# Altium project uAMDC.PrjPcb (part 1 of 3)
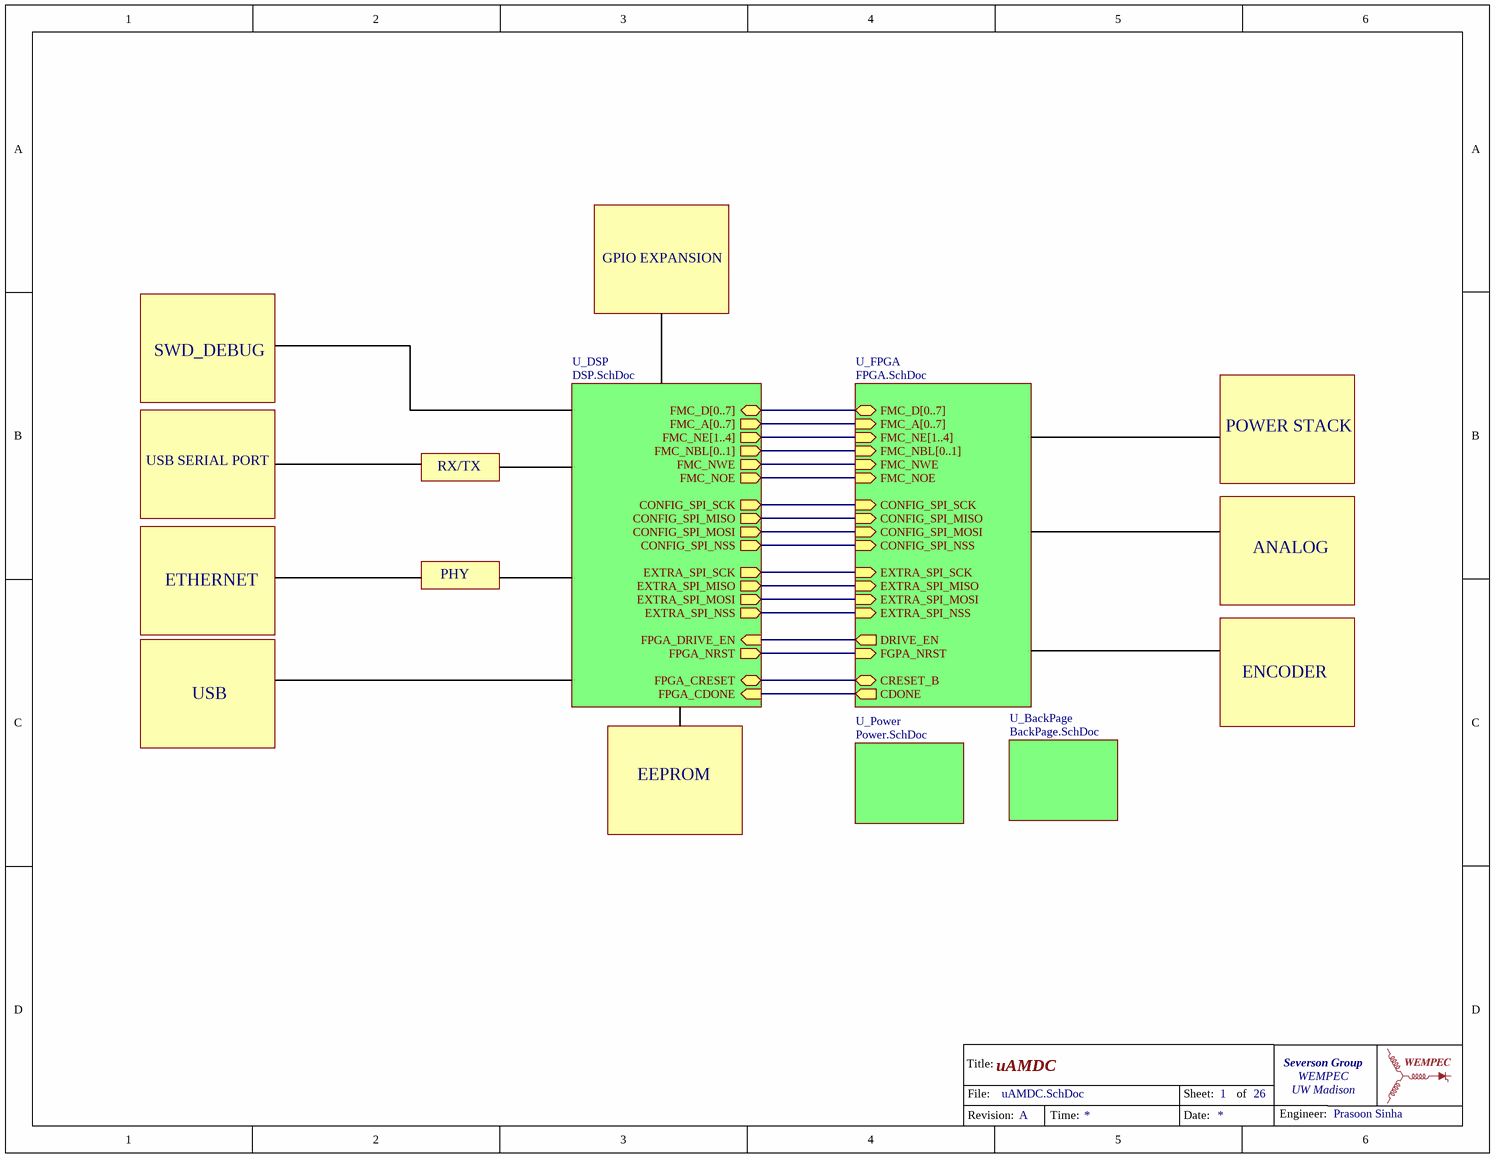
[diagram p0: uAMDC.SchDoc]
ProjectGroup: Severson Group; ProjectOrganization: WEMPEC; ProjectRev: A; ProjectUniversity: UW Madison
26 sheets, 427 parts. Net scope: hierarchical (ports join the sheet entries above them; power ports are global).
Board files: AMDC_uAMDC_Overlay.PcbDoc, uAMDC.PcbDoc
Sheets:
  uAMDC.SchDoc
    U_DSP = DSP.SchDoc
      U_GPIO = GPIO.SchDoc
        isoSPI1_Interface = isoSPI.SchDoc
        U_TranslationSPI_A = TranslationDir8Chan.SchDoc
        U_TranslationSPI_C = TranslationDir8Chan.SchDoc
        isoSPI2_Interface = isoSPI.SchDoc
        isoSPI3_Interface = isoSPI.SchDoc
        isoSPI4_Interface = isoSPI.SchDoc
      U_USB_UART = USB_UART.SchDoc
      U_SWD = SWD.SchDoc
      U_USB = USB.SchDoc
      U_Ethernet = Ethernet.SchDoc
    U_FPGA = FPGA.SchDoc
      U_DriveInterface = DriveInterface.SchDoc
        U_InverterConnectors = InverterConnectors.SchDoc
          InverterConnector1AB = InverterConnector.SchDoc
          InverterConnector2AB = InverterConnector.SchDoc
        U_InverterTranslation = InverterTranslation.SchDoc
          U_LVHV8ChanTranslation4 = LVHV8ChanTranslation.SchDoc
          U_LVHV8ChanTranslation5 = LVHV8ChanTranslation.SchDoc
          U_LVHV8ChanTranslation6 = LVHV8ChanTranslation.SchDoc
          U_TranslationStsA = TranslationDir8Chan.SchDoc
          U_TranslationStsB = TranslationDir8Chan.SchDoc
          U_TranslationStsC = TranslationDir8Chan.SchDoc
          U_TranslationStsD = TranslationDir8Chan.SchDoc
      U_AnalogInterface = AnalogInterface.SchDoc
        U_AnalogADC = AnalogADCs.SchDoc
        U_AnalogConnectors = AnalogConnectors.SchDoc
        U_AnalogConditioning = AnalogConditioning.SchDoc
          AnalogSigCond_A = AnalogSigCond.SchDoc
          AnalogSigCond_B = AnalogSigCond.SchDoc
      U_Encoder = Encoder.SchDoc
      U_BoardIO = FPGA_IO.SchDoc
    U_Power = Power.SchDoc
      U_Power_Protection = Power_Protection.SchDoc
      U_Power_InrushLimit = Power_InrushLimit.SchDoc
    U_BackPage = BackPage.SchDoc

## Sheet uAMDC.SchDoc: uAMDC
size 279 x 215 mm; Engineer: Prasoon Sinha; DocumentNumber: 1; SheetNumber: 1; SheetTotal: 26

### Parts
(Parts that share a designator on the sheet are numbered #1, #2 ... from top to bottom, then left to right.)
*?#1  TitleBlockWEMPEC  (value not drawn)  (graphical)

### Sub-sheets
U_BackPage = BackPage.SchDoc: no entries
U_DSP = DSP.SchDoc: FMC_A[0..7] (out), FMC_NBL[0..1] (out), FMC_D[0..7] (bidir), FMC_NWE (out), FMC_NOE (out), FMC_NE[1..4] (out), FPGA_DRIVE_EN (in), FPGA_CDONE (in), FPGA_NRST (out), EXTRA_SPI_SCK (out), CONFIG_SPI_MISO (out), CONFIG_SPI_MOSI (out), EXTRA_SPI_NSS (out), FPGA_CRESET (bidir), CONFIG_SPI_SCK (out), CONFIG_SPI_NSS (out), EXTRA_SPI_MOSI (out), EXTRA_SPI_MISO (out)
U_FPGA = FPGA.SchDoc: FMC_NWE (in), FMC_NE[1..4] (in), FMC_NBL[0..1] (in), FMC_A[0..7] (in), FMC_D[0..7] (bidir), FMC_NOE (in), CDONE (out), DRIVE_EN (out), FGPA_NRST (in), CONFIG_SPI_SCK (in), CONFIG_SPI_MOSI (in), CRESET_B (bidir), EXTRA_SPI_SCK (in), CONFIG_SPI_NSS (in), EXTRA_SPI_MISO (in), EXTRA_SPI_MOSI (in), EXTRA_SPI_NSS (in), CONFIG_SPI_MISO (in)
U_Power = Power.SchDoc: no entries

### Nets
CDONE: sheet U_DSP/FPGA_CDONE, sheet U_FPGA/CDONE
CONFIG_SPI5_MISO: sheet U_DSP/CONFIG_SPI_MISO, sheet U_FPGA/CONFIG_SPI_MISO
CONFIG_SPI5_MOSI: sheet U_DSP/CONFIG_SPI_MOSI, sheet U_FPGA/CONFIG_SPI_MOSI
CONFIG_SPI5_NSS: sheet U_DSP/CONFIG_SPI_NSS, sheet U_FPGA/CONFIG_SPI_NSS
CONFIG_SPI5_SCK: sheet U_DSP/CONFIG_SPI_SCK, sheet U_FPGA/CONFIG_SPI_SCK
CRESET_B: sheet U_DSP/FPGA_CRESET, sheet U_FPGA/CRESET_B
DRIVE_EN: sheet U_DSP/FPGA_DRIVE_EN, sheet U_FPGA/DRIVE_EN
EXTRA_SPI6_MISO: sheet U_DSP/EXTRA_SPI_MISO, sheet U_FPGA/EXTRA_SPI_MISO
EXTRA_SPI6_MOSI: sheet U_DSP/EXTRA_SPI_MOSI, sheet U_FPGA/EXTRA_SPI_MOSI
EXTRA_SPI6_NSS: sheet U_DSP/EXTRA_SPI_NSS, sheet U_FPGA/EXTRA_SPI_NSS
EXTRA_SPI6_SCK: sheet U_DSP/EXTRA_SPI_SCK, sheet U_FPGA/EXTRA_SPI_SCK
FMC_NOE: sheet U_DSP/FMC_NOE, sheet U_FPGA/FMC_NOE
FMC_NWE: sheet U_DSP/FMC_NWE, sheet U_FPGA/FMC_NWE
FPGA_NRST: sheet U_DSP/FPGA_NRST, sheet U_FPGA/FGPA_NRST

### Buses and harness runs
bus sheet U_DSP/FMC_A[0..7] = sheet U_FPGA/FMC_A[0..7]
bus sheet U_DSP/FMC_D[0..7] = sheet U_FPGA/FMC_D[0..7]
bus sheet U_DSP/FMC_NBL[0..1] = sheet U_FPGA/FMC_NBL[0..1]
bus sheet U_DSP/FMC_NE[1..4] = sheet U_FPGA/FMC_NE[1..4]

### Notes on the sheet
- GPIO EXPANSION
- SWD_DEBUG
- POWER STACK
- USB SERIAL PORT
- RX/TX
- ANALOG
- ETHERNET
- PHY
- USB
- ENCODER
- EEPROM
- (in symbol TitleBlockWEMPEC) Title:; File:; Sheet:; of; Engineer:; Revision:; Time:; Date:

## Sheet DSP.SchDoc: DSP Interface
size 431 x 254 mm; Engineer: Prasoon Sinha; DocumentNumber: 2; SheetNumber: 2; SheetTotal: 26
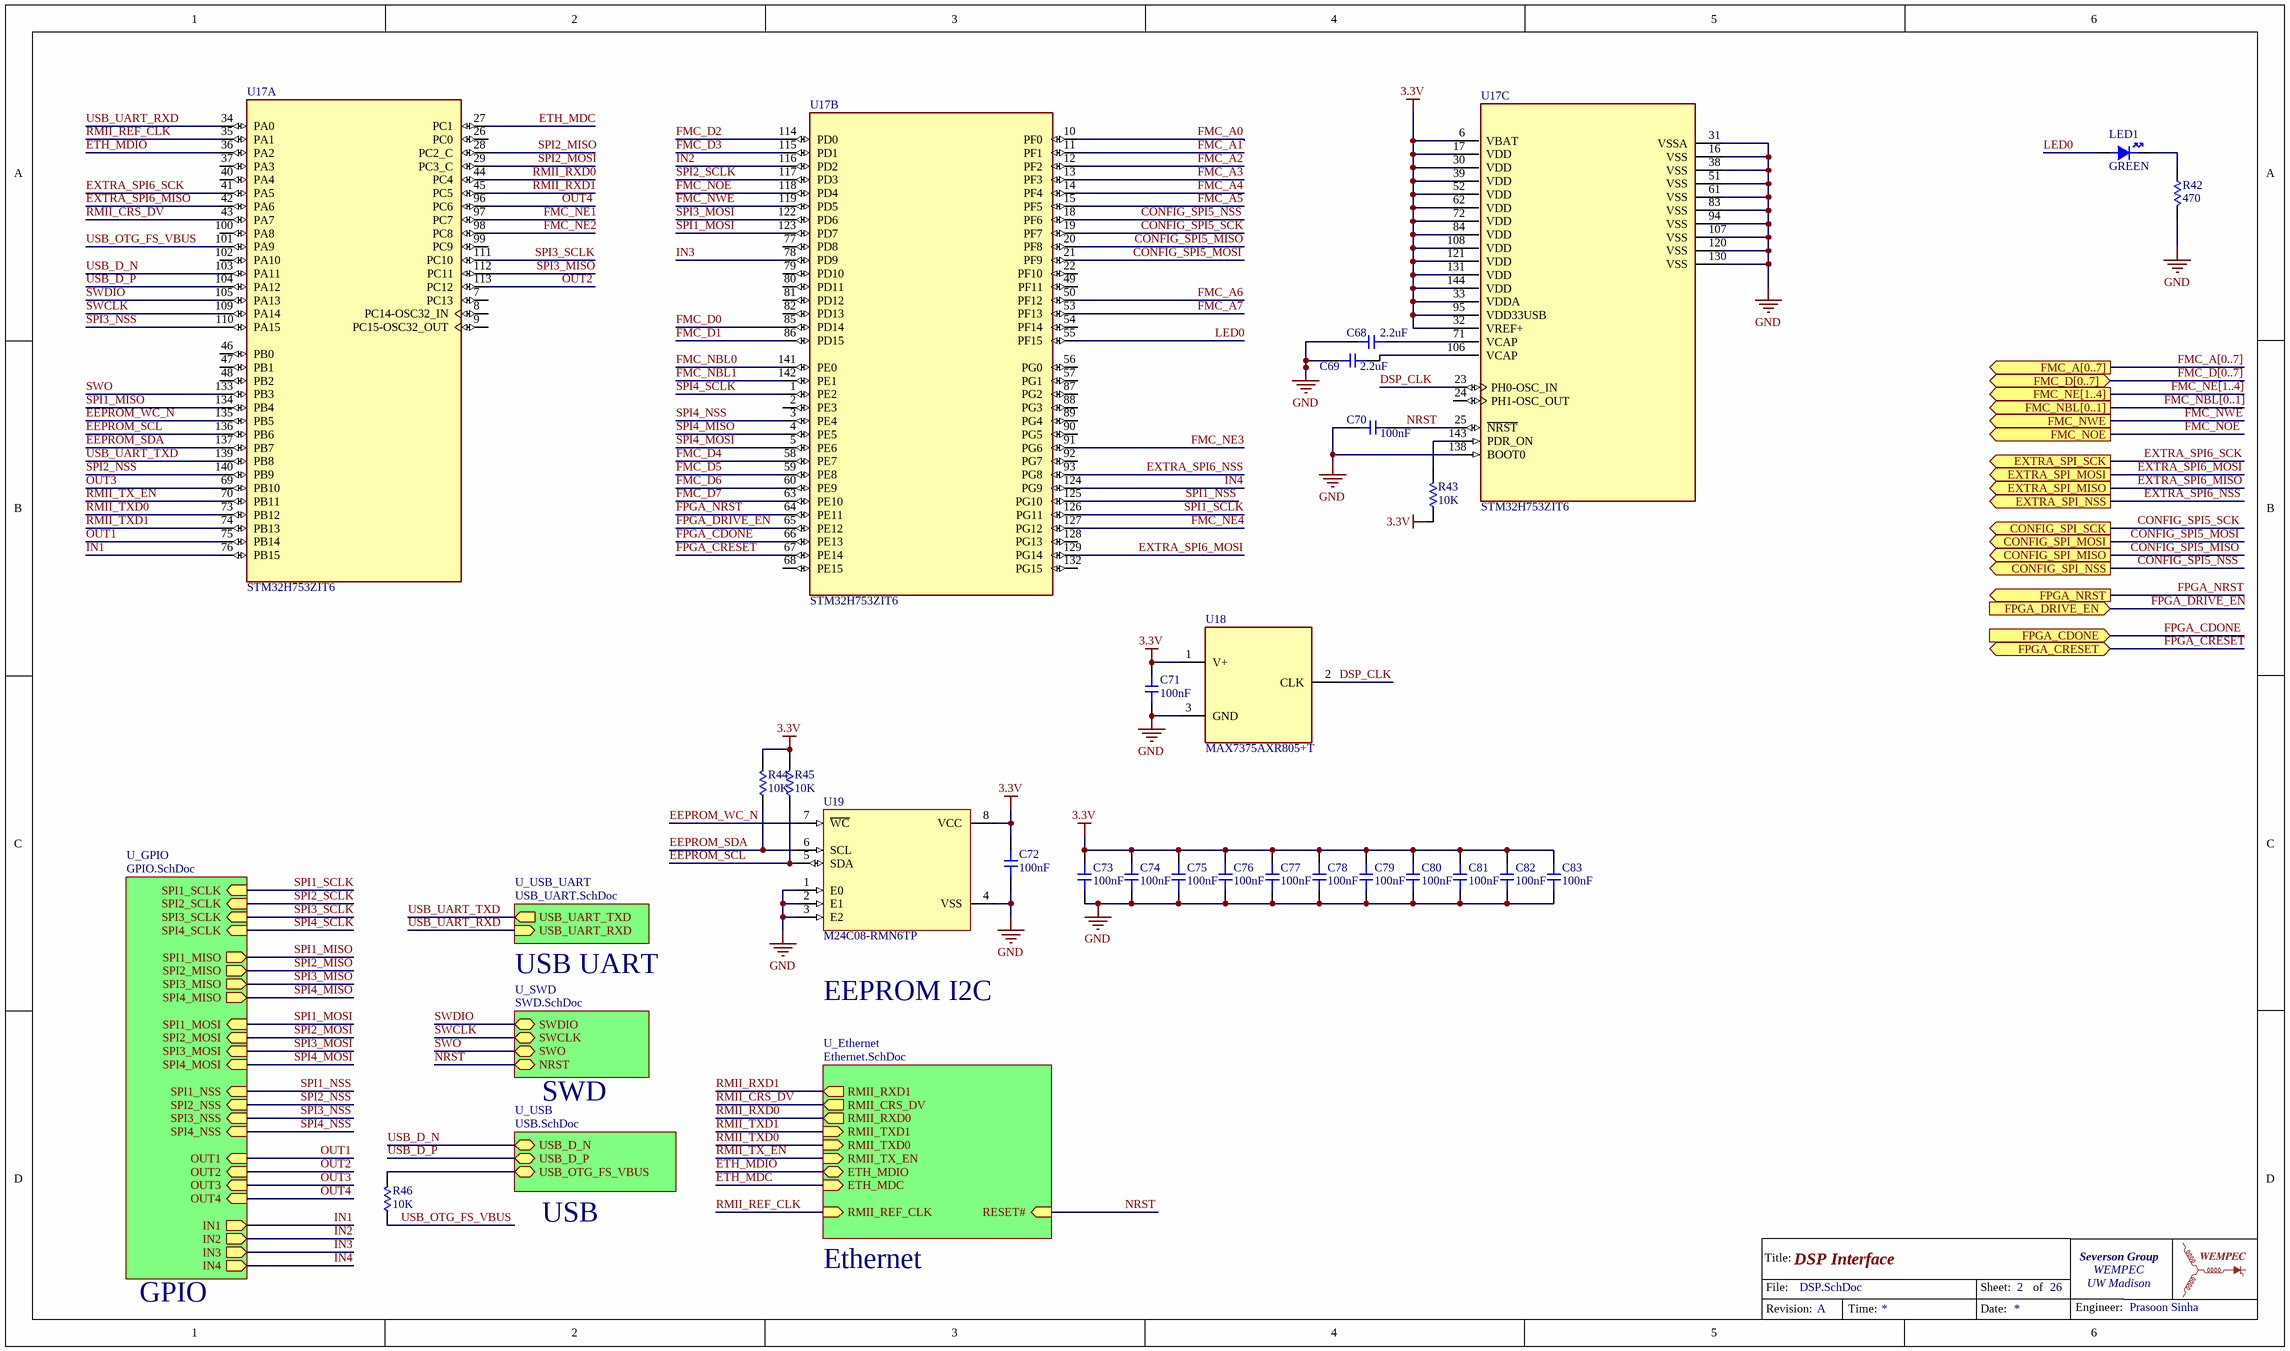
[diagram p1: DSP.SchDoc]

### Parts
(Parts that share a designator on the sheet are numbered #1, #2 ... from top to bottom, then left to right.)
*?#2  TitleBlockWEMPEC  (value not drawn)  (graphical)
C68  value 2.2uF  [0603-CAP]  (hidden comment: Capacitor)
C69  value 2.2uF  [0603-CAP]  (hidden comment: Capacitor)
C70  value 100nF  [0603-CAP]  (hidden comment: Capacitor)
C71  value 100nF  [0603-CAP]  (hidden comment: Capacitor)
C72  value 100nF  [0603-CAP]  (hidden comment: Capacitor)
C73  value 100nF  [0603-CAP]  (hidden comment: Capacitor)
C74  value 100nF  [0603-CAP]  (hidden comment: Capacitor)
C75  value 100nF  [0603-CAP]  (hidden comment: Capacitor)
C76  value 100nF  [0603-CAP]  (hidden comment: Capacitor)
C77  value 100nF  [0603-CAP]  (hidden comment: Capacitor)
C78  value 100nF  [0603-CAP]  (hidden comment: Capacitor)
C79  value 100nF  [0603-CAP]  (hidden comment: Capacitor)
C80  value 100nF  [0603-CAP]  (hidden comment: Capacitor)
C81  value 100nF  [0603-CAP]  (hidden comment: Capacitor)
C82  value 100nF  [0603-CAP]  (hidden comment: Capacitor)
C83  value 100nF  [0603-CAP]  (hidden comment: Capacitor)
LED1  value GREEN  [0603-LED]  (hidden comment: LED)
R42  value 470  [0603-RES]  (hidden comment: Resistor)
R43  value 10K  [0603-RES]  (hidden comment: Resistor)
R44  value 10K  [0603-RES]  (hidden comment: Resistor)
R45  value 10K  [0603-RES]  (hidden comment: Resistor)
R46  value 10K  [0603-RES]  (hidden comment: Resistor)
U17  STM32H753ZIT6  [QFP50P2200X2200X160-144N]  (parts A,B,C of 3)
U18  MAX7375AXR805+T  [SOT65P210X110-3N]
U19  M24C08-RMN6TP  [SOIC127P600X175-8N]

### Sub-sheets
U_Ethernet = Ethernet.SchDoc: RMII_RXD1 (out), RMII_CRS_DV (out), RMII_RXD0 (out), RMII_TXD1 (in), RMII_TXD0 (in), RMII_TX_EN (in), ETH_MDIO (bidir), ETH_MDC (in), RESET# (in), RMII_REF_CLK (in)
U_GPIO = GPIO.SchDoc: IN1 (out), IN3 (out), IN4 (out), OUT2 (in), OUT4 (in), OUT3 (in), OUT1 (in), IN2 (out), SPI4_MISO (out), SPI2_SCLK (in), SPI2_MISO (out), SPI1_SCLK (in), SPI1_MISO (out), SPI4_NSS (in), SPI2_NSS (in), SPI1_MOSI (in), SPI3_MOSI (in), SPI4_MOSI (in), SPI3_MISO (out), SPI3_SCLK (in), SPI1_NSS (in), SPI2_MOSI (in), SPI4_SCLK (in), SPI3_NSS (in)
U_SWD = SWD.SchDoc: NRST (bidir), SWO (bidir), SWCLK (bidir), SWDIO (bidir)
U_USB = USB.SchDoc: USB_D_N (bidir), USB_D_P (bidir), USB_OTG_FS_VBUS (bidir)
U_USB_UART = USB_UART.SchDoc: USB_UART_RXD (in), USB_UART_TXD (out)

### Ports
CONFIG_SPI_MISO (out), CONFIG_SPI_MOSI (out), CONFIG_SPI_NSS (out), CONFIG_SPI_SCK (out), EXTRA_SPI_MISO (out), EXTRA_SPI_MOSI (out), EXTRA_SPI_NSS (out), EXTRA_SPI_SCK (out), FMC_A[0..7] (out), FMC_D[0..7] (bidir), FMC_NBL[0..1] (out), FMC_NE[1..4] (out), FMC_NOE (out), FMC_NWE (out), FPGA_CDONE (in), FPGA_CRESET (bidir), FPGA_DRIVE_EN (in), FPGA_NRST (out)

### Nets
3.3V: C71.2 C72.2 C73.2 C74.2 C75.2 C76.2 C77.2 C78.2 C79.2 C80.2 C81.2 C82.2 C83.2 R43.1 R44.2 R45.2 U17.6(VBAT) U17.17(VDD) U17.30(VDD) U17.32(VREF+) U17.33(VDDA) U17.39(VDD) U17.52(VDD) U17.62(VDD) U17.72(VDD) U17.84(VDD) U17.95(VDD33USB) U17.108(VDD) U17.121(VDD) U17.131(VDD) U17.144(VDD) U18.1(V+) U19.8(VCC)
GND: C68.2 C69.2 C70.2 C71.1 C72.1 C73.1 C74.1 C75.1 C76.1 C77.1 C78.1 C79.1 C80.1 C81.1 C82.1 C83.1 R42.2 U17.16(VSS) U17.31(VSSA) U17.38(VSS) U17.51(VSS) U17.61(VSS) U17.83(VSS) U17.94(VSS) U17.107(VSS) U17.120(VSS) U17.130(VSS) U17.138(BOOT0) U18.3(GND) U19.1(E0) U19.2(E1) U19.3(E2) U19.4(VSS)
CONFIG_SPI5_MISO: U17.20(PF8) ; port CONFIG_SPI_MISO
CONFIG_SPI5_MOSI: U17.21(PF9) ; port CONFIG_SPI_MOSI
CONFIG_SPI5_NSS: U17.18(PF6) ; port CONFIG_SPI_NSS
CONFIG_SPI5_SCK: U17.19(PF7) ; port CONFIG_SPI_SCK
DSP_CLK: U17.23(PH0-OSC_IN) U18.2(CLK)
EEPROM_SCL: R45.1 U17.136(PB6) U19.5(SDA)
EEPROM_SDA: R44.1 U17.137(PB7) U19.6(SCL)
EEPROM_WC_N: U17.135(PB5) U19.7(~{WC})
ETH_MDC: U17.27(PC1) ; sheet U_Ethernet/ETH_MDC
ETH_MDIO: U17.36(PA2) ; sheet U_Ethernet/ETH_MDIO
EXTRA_SPI6_MISO: U17.42(PA6) ; port EXTRA_SPI_MISO
EXTRA_SPI6_MOSI: U17.129(PG14) ; port EXTRA_SPI_MOSI
EXTRA_SPI6_NSS: U17.93(PG8) ; port EXTRA_SPI_NSS
EXTRA_SPI6_SCK: U17.41(PA5) ; port EXTRA_SPI_SCK
FMC_A0: U17.10(PF0)
FMC_A1: U17.11(PF1)
FMC_A2: U17.12(PF2)
FMC_A3: U17.13(PF3)
FMC_A4: U17.14(PF4)
FMC_A5: U17.15(PF5)
FMC_A6: U17.50(PF12)
FMC_A7: U17.53(PF13)
FMC_D0: U17.85(PD14)
FMC_D1: U17.86(PD15)
FMC_D2: U17.114(PD0)
FMC_D3: U17.115(PD1)
FMC_D4: U17.58(PE7)
FMC_D5: U17.59(PE8)
FMC_D6: U17.60(PE9)
FMC_D7: U17.63(PE10)
FMC_NBL0: U17.141(PE0)
FMC_NBL1: U17.142(PE1)
FMC_NE1: U17.97(PC7)
FMC_NE2: U17.98(PC8)
FMC_NE3: U17.91(PG6)
FMC_NE4: U17.127(PG12)
FMC_NOE: U17.118(PD4) ; port FMC_NOE
FMC_NWE: U17.119(PD5) ; port FMC_NWE
FPGA_CDONE: U17.66(PE13) ; port FPGA_CDONE  [project net CDONE]
FPGA_CRESET: U17.67(PE14) ; port FPGA_CRESET  [project net CRESET_B]
FPGA_DRIVE_EN: U17.65(PE12) ; port FPGA_DRIVE_EN  [project net DRIVE_EN]
FPGA_NRST: U17.64(PE11) ; port FPGA_NRST
IN1: U17.76(PB15) ; sheet U_GPIO/IN1
IN2: U17.116(PD2) ; sheet U_GPIO/IN2
IN3: U17.78(PD9) ; sheet U_GPIO/IN3
IN4: U17.124(PG9) ; sheet U_GPIO/IN4
LED0: LED1.A U17.55(PF15)
NRST: C70.1 U17.25(~{NRST}) ; sheet U_SWD/NRST, sheet U_Ethernet/RESET#
OUT1: U17.75(PB14) ; sheet U_GPIO/OUT1
OUT2: U17.113(PC12) ; sheet U_GPIO/OUT2
OUT3: U17.69(PB10) ; sheet U_GPIO/OUT3
OUT4: U17.96(PC6) ; sheet U_GPIO/OUT4
RMII_CRS_DV: U17.43(PA7) ; sheet U_Ethernet/RMII_CRS_DV
RMII_REF_CLK: U17.35(PA1) ; sheet U_Ethernet/RMII_REF_CLK
RMII_RXD0: U17.44(PC4) ; sheet U_Ethernet/RMII_RXD0
RMII_RXD1: U17.45(PC5) ; sheet U_Ethernet/RMII_RXD1
RMII_TX_EN: U17.70(PB11) ; sheet U_Ethernet/RMII_TX_EN
RMII_TXD0: U17.73(PB12) ; sheet U_Ethernet/RMII_TXD0
RMII_TXD1: U17.74(PB13) ; sheet U_Ethernet/RMII_TXD1
SPI1_MISO: U17.134(PB4) ; sheet U_GPIO/SPI1_MISO
SPI1_MOSI: U17.123(PD7) ; sheet U_GPIO/SPI1_MOSI
SPI1_NSS: U17.125(PG10) ; sheet U_GPIO/SPI1_NSS
SPI1_SCLK: U17.126(PG11) ; sheet U_GPIO/SPI1_SCLK
SPI2_MISO: U17.28(PC2_C) ; sheet U_GPIO/SPI2_MISO
SPI2_MOSI: U17.29(PC3_C) ; sheet U_GPIO/SPI2_MOSI
SPI2_NSS: U17.140(PB9) ; sheet U_GPIO/SPI2_NSS
SPI2_SCLK: U17.117(PD3) ; sheet U_GPIO/SPI2_SCLK
SPI3_MISO: U17.112(PC11) ; sheet U_GPIO/SPI3_MISO
SPI3_MOSI: U17.122(PD6) ; sheet U_GPIO/SPI3_MOSI
SPI3_NSS: U17.110(PA15) ; sheet U_GPIO/SPI3_NSS
SPI3_SCLK: U17.111(PC10) ; sheet U_GPIO/SPI3_SCLK
SPI4_MISO: U17.4(PE5) ; sheet U_GPIO/SPI4_MISO
SPI4_MOSI: U17.5(PE6) ; sheet U_GPIO/SPI4_MOSI
SPI4_NSS: U17.3(PE4) ; sheet U_GPIO/SPI4_NSS
SPI4_SCLK: U17.1(PE2) ; sheet U_GPIO/SPI4_SCLK
SWCLK: U17.109(PA14) ; sheet U_SWD/SWCLK
SWDIO: U17.105(PA13) ; sheet U_SWD/SWDIO
SWO: U17.133(PB3) ; sheet U_SWD/SWO
USB_D_N: U17.103(PA11) ; sheet U_USB/USB_D_N
USB_D_P: U17.104(PA12) ; sheet U_USB/USB_D_P
USB_OTG_FS_VBUS: R46.1 U17.101(PA9)
USB_UART_RXD: U17.34(PA0) ; sheet U_USB_UART/USB_UART_RXD
USB_UART_TXD: U17.139(PB8) ; sheet U_USB_UART/USB_UART_TXD
NetC68_1: C68.1 U17.71(VCAP)
NetC69_1: C69.1 U17.106(VCAP)
NetC144_1: R46.2 ; sheet U_USB/USB_OTG_FS_VBUS
NetLED1_C: LED1.C R42.1
NetR43_2: R43.2 U17.143(PDR_ON)

Not connected (* = marked no-connect by the designer): U17 2(PE3) 7(PC13) 8(PC14-OSC32_IN) 9(PC15-OSC32_OUT) 22(PF10) 24(PH1-OSC_OUT) 26(PC0) 37(PA3) 40(PA4) 46(PB0) 47(PB1) 48(PB2) 49(PF11) 54(PF14) 56(PG0) 57(PG1) 68(PE15) 77(PD8) 79(PD10) 80(PD11) 81(PD12) 82(PD13) 87(PG2) 88(PG3) 89(PG4) 90(PG5) 92(PG7) 99(PC9) 100(PA8) 102(PA10) 128(PG13) 132(PG15)

### Buses and harness runs
bus FMC_A[0..7] = port FMC_A[0..7]
bus FMC_D[0..7] = port FMC_D[0..7]
bus FMC_NBL[0..1] = port FMC_NBL[0..1]
bus FMC_NE[1..4] = port FMC_NE[1..4]

### Notes on the sheet
- USB UART
- EEPROM I2C
- SWD
- USB
- GPIO
- Ethernet
- (in symbol TitleBlockWEMPEC) Title:; File:; Sheet:; of; Engineer:; Revision:; Time:; Date:

### Library data of the parts
U17 = STM32H753ZIT6: DSP - LQFP 144 20X20X1.4 2; Supplier Part Number 1: 497-18568-ND
U18 = MAX7375AXR805+T: 8MHz XO (Standard) CMOS Oscillator 2.7V ~ 5.5V SC-70, SOT-323; Supplier Part Number 1: MAX7375AXR805+TCT-ND
U19 = M24C08-RMN6TP: EEPROM Memory IC 8Kb (1K x 8) I²C 400kHz 900ns 8-SO; Supplier Part Number 1: 497-8637-1-ND
C68-C83 = Capacitor: Supplier 1: Digi-Key
  C68 C69: Supplier Part Number 1: 490-12738-1-ND
  C70-C72: Supplier Part Number 1: 311-4055-1-ND
  C73-C83: Supplier Part Number 1: 1276-1012-1-ND
LED1 = LED: Supplier 1: Digi-Key; Supplier Part Number 1: 160-1446-1-ND
R42-R46 = Resistor: Supplier 1: Digi-Key
  R42: Supplier Part Number 1: 541-4038-1-ND
  R43-R46: Supplier Part Number 1: 541-5136-1-ND

## Sheet GPIO.SchDoc: GPIO
size Letter; Engineer: Prasoon Sinha; DocumentNumber: 4; Revision: v1.2; SheetNumber: 4; SheetTotal: 26
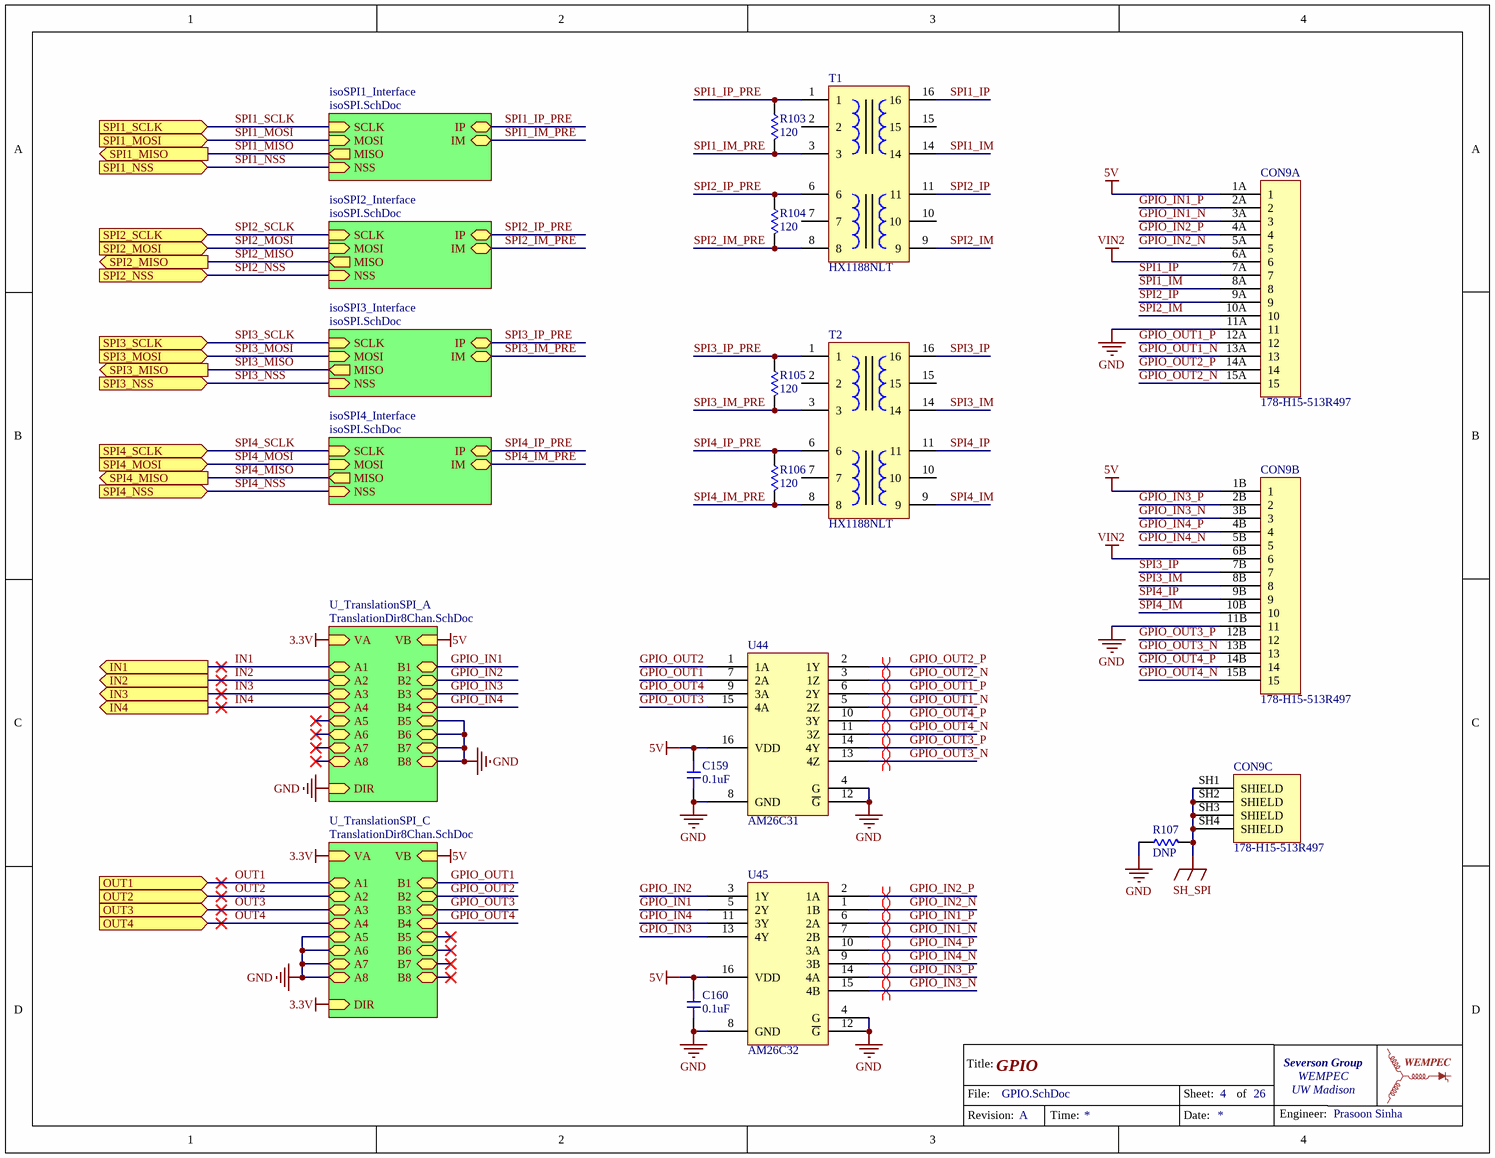
[diagram p2: GPIO.SchDoc]

### Parts
C159  value 0.1uF  [0603-CAP]  (hidden comment: Capacitor)
C160  value 0.1uF  [0603-CAP]  (hidden comment: Capacitor)
CON9  178-H15-513R497  [178-H15-513R497]  (parts A,B,C of 3)
R103  value 120  [0603-RES]  (hidden comment: Resistor)
R104  value 120  [0603-RES]  (hidden comment: Resistor)
R105  value 120  [0603-RES]  (hidden comment: Resistor)
R106  value 120  [0603-RES]  (hidden comment: Resistor)
R107  value DNP  [0603-RES]  (hidden comment: Resistor)
T1  HX1188NLT  [HX1188NLT]
T2  HX1188NLT  [HX1188NLT]
U44  AM26C31  [TSOP65P640X120-16N]
U45  AM26C32  [TSOP65P640X120-16N]

### Sub-sheets
isoSPI1_Interface = isoSPI.SchDoc: IM (bidir), IP (bidir), NSS (in), MOSI (in), SCLK (in), MISO (out)
isoSPI2_Interface = isoSPI.SchDoc: IM (bidir), IP (bidir), NSS (in), MOSI (in), SCLK (in), MISO (out)
isoSPI3_Interface = isoSPI.SchDoc: IM (bidir), IP (bidir), NSS (in), MOSI (in), SCLK (in), MISO (out)
isoSPI4_Interface = isoSPI.SchDoc: IM (bidir), IP (bidir), NSS (in), MOSI (in), SCLK (in), MISO (out)
U_TranslationSPI_A = TranslationDir8Chan.SchDoc: VB (in), VA (in), B1 (bidir), B2 (bidir), B3 (bidir), B4 (bidir), B5 (bidir), B6 (bidir), B7 (bidir), B8 (bidir), A1 (bidir), A2 (bidir), A3 (bidir), A4 (bidir), A5 (bidir), A6 (bidir), A7 (bidir), A8 (bidir), DIR (in)
U_TranslationSPI_C = TranslationDir8Chan.SchDoc: VB (in), VA (in), B1 (bidir), B2 (bidir), B3 (bidir), B4 (bidir), B5 (bidir), B6 (bidir), B7 (bidir), B8 (bidir), A1 (bidir), A2 (bidir), A3 (bidir), A4 (bidir), A5 (bidir), A6 (bidir), A7 (bidir), A8 (bidir), DIR (in)

### Ports
IN1 (out), IN2 (out), IN3 (out), IN4 (out), OUT1 (in), OUT2 (in), OUT3 (in), OUT4 (in), SPI1_MISO (out), SPI1_MOSI (in), SPI1_NSS (in), SPI1_SCLK (in), SPI2_MISO (out), SPI2_MOSI (in), SPI2_NSS (in), SPI2_SCLK (in), SPI3_MISO (out), SPI3_MOSI (in), SPI3_NSS (in), SPI3_SCLK (in), SPI4_MISO (out), SPI4_MOSI (in), SPI4_NSS (in), SPI4_SCLK (in)

### Nets
3.3V: sheet U_TranslationSPI_A/VA, sheet U_TranslationSPI_C/VA, sheet U_TranslationSPI_C/DIR
5V: C159.1 C160.1 CON9.1A(1) CON9.1B(1) U44.16(VDD) U45.16(VDD) ; sheet U_TranslationSPI_A/VB, sheet U_TranslationSPI_C/VB
GND: C159.2 C160.2 CON9.11A(11) CON9.11B(11) R107.1 U44.4(G) U44.8(GND) U44.12(~{G}) U45.4(G) U45.8(GND) U45.12(~{G}) ; sheet U_TranslationSPI_A/B5, sheet U_TranslationSPI_A/B6, sheet U_TranslationSPI_A/B7, sheet U_TranslationSPI_A/B8, sheet U_TranslationSPI_A/DIR, sheet U_TranslationSPI_C/A5, sheet U_TranslationSPI_C/A6, sheet U_TranslationSPI_C/A7, sheet U_TranslationSPI_C/A8
SH_SPI: CON9.SH1(SHIELD) CON9.SH2(SHIELD) CON9.SH3(SHIELD) CON9.SH4(SHIELD) R107.2
VIN2: CON9.6A(6) CON9.6B(6)
GPIO_IN1: U45.5(2Y) ; sheet U_TranslationSPI_A/B1
GPIO_IN1_N: CON9.3A(3) U45.7(2B)
GPIO_IN1_P: CON9.2A(2) U45.6(2A)
GPIO_IN2: U45.3(1Y) ; sheet U_TranslationSPI_A/B2
GPIO_IN2_N: CON9.5A(5) U45.1(1B)
GPIO_IN2_P: CON9.4A(4) U45.2(1A)
GPIO_IN3: U45.13(4Y) ; sheet U_TranslationSPI_A/B3
GPIO_IN3_N: CON9.3B(3) U45.15(4B)
GPIO_IN3_P: CON9.2B(2) U45.14(4A)
GPIO_IN4: U45.11(3Y) ; sheet U_TranslationSPI_A/B4
GPIO_IN4_N: CON9.5B(5) U45.9(3B)
GPIO_IN4_P: CON9.4B(4) U45.10(3A)
GPIO_OUT1: U44.7(2A) ; sheet U_TranslationSPI_C/B1
GPIO_OUT1_N: CON9.13A(13) U44.5(2Z)
GPIO_OUT1_P: CON9.12A(12) U44.6(2Y)
GPIO_OUT2: U44.1(1A) ; sheet U_TranslationSPI_C/B2
GPIO_OUT2_N: CON9.15A(15) U44.3(1Z)
GPIO_OUT2_P: CON9.14A(14) U44.2(1Y)
GPIO_OUT3: U44.15(4A) ; sheet U_TranslationSPI_C/B3
GPIO_OUT3_N: CON9.13B(13) U44.13(4Z)
GPIO_OUT3_P: CON9.12B(12) U44.14(4Y)
GPIO_OUT4: U44.9(3A) ; sheet U_TranslationSPI_C/B4
GPIO_OUT4_N: CON9.15B(15) U44.11(3Z)
GPIO_OUT4_P: CON9.14B(14) U44.10(3Y)
IN1: port IN1, sheet U_TranslationSPI_A/A1
IN2: port IN2, sheet U_TranslationSPI_A/A2
IN3: port IN3, sheet U_TranslationSPI_A/A3
IN4: port IN4, sheet U_TranslationSPI_A/A4
OUT1: port OUT1, sheet U_TranslationSPI_C/A1
OUT2: port OUT2, sheet U_TranslationSPI_C/A2
OUT3: port OUT3, sheet U_TranslationSPI_C/A3
OUT4: port OUT4, sheet U_TranslationSPI_C/A4
SPI1_IM: CON9.8A(8) T1.14
SPI1_IM_PRE: R103.2 T1.3 ; sheet isoSPI1_Interface/IM  [project net IM]
SPI1_IP: CON9.7A(7) T1.16
SPI1_IP_PRE: R103.1 T1.1 ; sheet isoSPI1_Interface/IP  [project net IP]
SPI1_MISO: port SPI1_MISO, sheet isoSPI1_Interface/MISO
SPI1_MOSI: port SPI1_MOSI, sheet isoSPI1_Interface/MOSI
SPI1_NSS: port SPI1_NSS, sheet isoSPI1_Interface/NSS
SPI1_SCLK: port SPI1_SCLK, sheet isoSPI1_Interface/SCLK
SPI2_IM: CON9.10A(10) T1.9
SPI2_IM_PRE: R104.2 T1.8 ; sheet isoSPI2_Interface/IM  [project net IM]
SPI2_IP: CON9.9A(9) T1.11
SPI2_IP_PRE: R104.1 T1.6 ; sheet isoSPI2_Interface/IP  [project net IP]
SPI2_MISO: port SPI2_MISO, sheet isoSPI2_Interface/MISO
SPI2_MOSI: port SPI2_MOSI, sheet isoSPI2_Interface/MOSI
SPI2_NSS: port SPI2_NSS, sheet isoSPI2_Interface/NSS
SPI2_SCLK: port SPI2_SCLK, sheet isoSPI2_Interface/SCLK
SPI3_IM: CON9.8B(8) T2.14
SPI3_IM_PRE: R105.2 T2.3 ; sheet isoSPI3_Interface/IM  [project net IM]
SPI3_IP: CON9.7B(7) T2.16
SPI3_IP_PRE: R105.1 T2.1 ; sheet isoSPI3_Interface/IP  [project net IP]
SPI3_MISO: port SPI3_MISO, sheet isoSPI3_Interface/MISO
SPI3_MOSI: port SPI3_MOSI, sheet isoSPI3_Interface/MOSI
SPI3_NSS: port SPI3_NSS, sheet isoSPI3_Interface/NSS
SPI3_SCLK: port SPI3_SCLK, sheet isoSPI3_Interface/SCLK
SPI4_IM: CON9.10B(10) T2.9
SPI4_IM_PRE: R106.2 T2.8 ; sheet isoSPI4_Interface/IM  [project net IM]
SPI4_IP: CON9.9B(9) T2.11
SPI4_IP_PRE: R106.1 T2.6 ; sheet isoSPI4_Interface/IP  [project net IP]
SPI4_MISO: port SPI4_MISO, sheet isoSPI4_Interface/MISO
SPI4_MOSI: port SPI4_MOSI, sheet isoSPI4_Interface/MOSI
SPI4_NSS: port SPI4_NSS, sheet isoSPI4_Interface/NSS
SPI4_SCLK: port SPI4_SCLK, sheet isoSPI4_Interface/SCLK

Not connected (* = marked no-connect by the designer): T1 2 7 10 15; T2 2 7 10 15

### Layout directives
differential pair: GPIO_IN1_N, GPIO_IN1_P, GPIO_IN2_N, GPIO_IN2_P, GPIO_IN3_N, GPIO_IN3_P, GPIO_IN4_N, GPIO_IN4_P, GPIO_OUT1_N, GPIO_OUT1_P, GPIO_OUT2_N, GPIO_OUT2_P, GPIO_OUT3_N, GPIO_OUT3_P, GPIO_OUT4_N, GPIO_OUT4_P

### Notes on the sheet
- Title:
- File:
- Sheet:
- of
- Revision:
- Time:
- Date:
- Engineer:

### Library data of the parts
CON9 = 178-H15-513R497: CONN D-SUB RCPT/RCPT 15/15POS RA; Supplier 1: Digi-Key; Supplier Part Number 1: NOR1832-ND
T1 T2 = HX1188NLT: XFRMR MAGNETIC 1PORT 1:1 10/100; Supplier 1: Digi-Key; Supplier Part Number 1: 553-1536-1-ND
U44 = AM26C31: IC DRIVER 4/0 16TSSOP; Supplier 1: Digi-Key; Supplier Part Number 1: 296-30087-1-ND
U45 = AM26C32: IC RCVR RS422 QUAD DIFF 16TSSOP; Supplier 1: Digi-Key; Supplier Part Number 1: 296-30088-1-ND
C159 C160 = Capacitor: Supplier 1: Digi-Key; Supplier Part Number 1: 1276-1012-1-ND
R103-R107 = Resistor: Supplier 1: Digi-Key
  R103-R106: Supplier Part Number 1: 311-120HRCT-ND
  R107: Supplier Part Number 1: P0.0GCT-ND

## Sheet isoSPI.SchDoc: isoSPI Interface
size Letter; Engineer: Nathan Petersen; DocumentNumber: 5; SheetNumber: 5; SheetTotal: 26
Used 4 times, as channels U_DSP/U_GPIO/isoSPI1_Interface, U_DSP/U_GPIO/isoSPI2_Interface, U_DSP/U_GPIO/isoSPI3_Interface, U_DSP/U_GPIO/isoSPI4_Interface. Parts and nets are listed once, with the designators drawn on the sheet.
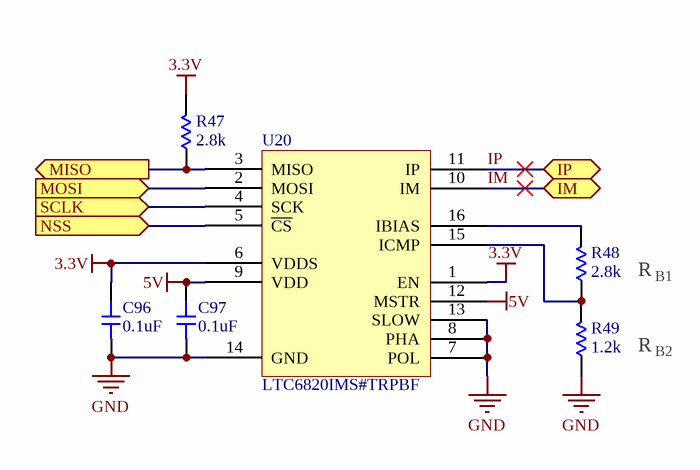
[diagram p3: isoSPI.SchDoc]

### Parts
C96  value 0.1uF  [0603-CAP]  (hidden comment: Capacitor)
C97  value 0.1uF  [0603-CAP]  (hidden comment: Capacitor)
R47  value 2.8k  [0603-RES]  (hidden comment: Resistor)
R48  value 2.8k  [0603-RES]  (hidden comment: Resistor)
R49  value 1.2k  [0603-RES]  (hidden comment: Resistor)
U20  LTC6820IMS#TRPBF  [TSSOP50P490X110-16N]

### Ports
IM (bidir), IP (bidir), MISO (out), MOSI (in), NSS (in), SCLK (in)

### Nets
3.3V: C96.2 R47.2 U20.1(EN) U20.6(VDDS)
5V: C97.2 U20.9(VDD) U20.12(MSTR)
GND: C96.1 C97.1 R49.1 U20.7(POL) U20.8(PHA) U20.13(SLOW) U20.14(GND)
IM: U20.10(IM) ; port IM
IP: U20.11(IP) ; port IP
MISO: R47.1 U20.3(MISO) ; port MISO
MOSI: U20.2(MOSI) ; port MOSI
NSS: U20.5(~{CS}) ; port NSS
SCLK: U20.4(SCK) ; port SCLK
NetR48_1: R48.1 R49.2 U20.15(ICMP)
NetR48_2: R48.2 U20.16(IBIAS)

### Channels
U_DSP/U_GPIO/isoSPI1_Interface: designators end in A; ports IM=IM IP=IP MISO=SPI1_MISO MOSI=SPI1_MOSI NSS=SPI1_NSS SCLK=SPI1_SCLK
U_DSP/U_GPIO/isoSPI2_Interface: designators end in B; ports IM=IM IP=IP MISO=SPI2_MISO MOSI=SPI2_MOSI NSS=SPI2_NSS SCLK=SPI2_SCLK
U_DSP/U_GPIO/isoSPI3_Interface: designators end in C; ports IM=IM IP=IP MISO=SPI3_MISO MOSI=SPI3_MOSI NSS=SPI3_NSS SCLK=SPI3_SCLK
U_DSP/U_GPIO/isoSPI4_Interface: designators end in D; ports IM=IM IP=IP MISO=SPI4_MISO MOSI=SPI4_MOSI NSS=SPI4_NSS SCLK=SPI4_SCLK

### Notes on the sheet
- R
- B1
- B2
- Title:
- File:
- Sheet:
- of
- Revision:
- Time:
- Date:
- Engineer:

### Library data of the parts
U20 = LTC6820IMS#TRPBF: IC INTERFACE SPECIALIZED 16MSOP; Supplier 1: Digi-Key; Supplier Part Number 1: LTC6820IMS#TRPBFCT-ND
C96 C97 = Capacitor: Supplier 1: Digi-Key; Supplier Part Number 1: 1276-1012-1-ND
R47-R49 = Resistor: Supplier 1: Digi-Key
  R47 R48: Supplier Part Number 1: 311-2.80KHRCT-ND
  R49: Supplier Part Number 1: 311-1.20KHRCT-ND

## Sheet TranslationDir8Chan.SchDoc: 8-Channel Directional Translation
size Letter; Engineer: Nathan Petersen; DocumentNumber: 6; Revision: v1.2; SheetNumber: 6; SheetTotal: 26
Used 6 times, as channels U_DSP/U_GPIO/U_TranslationSPI_A, U_DSP/U_GPIO/U_TranslationSPI_C, U_FPGA/U_DriveInterface/U_InverterTranslation/U_TranslationStsA, U_FPGA/U_DriveInterface/U_InverterTranslation/U_TranslationStsB, U_FPGA/U_DriveInterface/U_InverterTranslation/U_TranslationStsC, U_FPGA/U_DriveInterface/U_InverterTranslation/U_TranslationStsD. Parts and nets are listed once, with the designators drawn on the sheet.
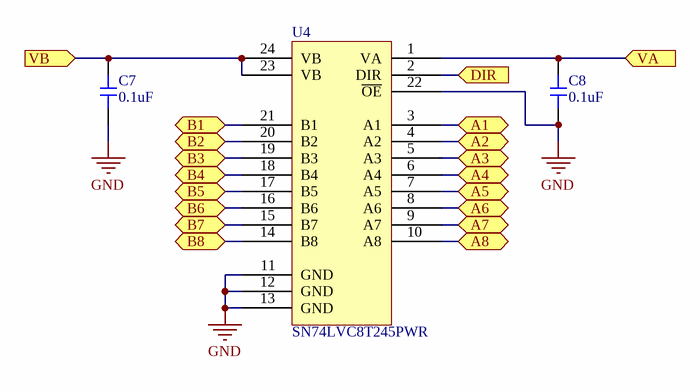
[diagram p4: TranslationDir8Chan.SchDoc]

### Parts
C7  value 0.1uF  [0603-CAP]  (hidden comment: Capacitor)
C8  value 0.1uF  [0603-CAP]  (hidden comment: Capacitor)
U4  SN74LVC8T245PWR  [TSOP65P640X120-24N]

### Ports
A1 (bidir), A2 (bidir), A3 (bidir), A4 (bidir), A5 (bidir), A6 (bidir), A7 (bidir), A8 (bidir), B1 (bidir), B2 (bidir), B3 (bidir), B4 (bidir), B5 (bidir), B6 (bidir), B7 (bidir), B8 (bidir), DIR (in), VA (in), VB (in)

### Nets
GND: C7.2 C8.2 U4.11(GND) U4.12(GND) U4.13(GND) U4.22(~{OE})
A1: U4.3(A1) ; port A1
A2: U4.4(A2) ; port A2
A3: U4.5(A3) ; port A3
A4: U4.6(A4) ; port A4
A5: U4.7(A5) ; port A5
A6: U4.8(A6) ; port A6
A7: U4.9(A7) ; port A7
A8: U4.10(A8) ; port A8
B1: U4.21(B1) ; port B1
B2: U4.20(B2) ; port B2
B3: U4.19(B3) ; port B3
B4: U4.18(B4) ; port B4
B5: U4.17(B5) ; port B5
B6: U4.16(B6) ; port B6
B7: U4.15(B7) ; port B7
B8: U4.14(B8) ; port B8
DIR: U4.2(DIR) ; port DIR
VA: C8.1 U4.1(VA) ; port VA
VB: C7.1 U4.23(VB) U4.24(VB) ; port VB

### Channels
U_DSP/U_GPIO/U_TranslationSPI_A: designators end in A; ports A1=IN1 A2=IN2 A3=IN3 A4=IN4 A5=NetU4A_7 A6=NetU4A_8 A7=NetU4A_9 A8=NetU4A_10 B1=GPIO_IN1 B2=GPIO_IN2 B3=GPIO_IN3 B4=GPIO_IN4 B5=GND B6=GND B7=GND B8=GND DIR=GND VA=3.3V VB=5V
U_DSP/U_GPIO/U_TranslationSPI_C: designators end in B; ports A1=OUT1 A2=OUT2 A3=OUT3 A4=OUT4 A5=GND A6=GND A7=GND A8=GND B1=GPIO_OUT1 B2=GPIO_OUT2 B3=GPIO_OUT3 B4=GPIO_OUT4 B5=NetU4B_17 B6=NetU4B_16 B7=NetU4B_15 B8=NetU4B_14 DIR=3.3V VA=3.3V VB=5V
U_FPGA/U_DriveInterface/U_InverterTranslation/U_TranslationStsA: designators end in C; ports A1=LV_INV_STS_A1 A2=LV_INV_STS_A2 A3=LV_INV_STS_A3 A4=LV_INV_STS_A4 A5=NetU4C_7 A6=NetU4C_8 A7=NetU4C_9 A8=NetU4C_10 B1=INV_STS_A1 B2=INV_STS_A2 B3=INV_STS_A3 B4=INV_STS_A4 B5=NetU4C_17 B6=NetU4C_16 B7=NetU4C_15 B8=NetU4C_14 DIR=INV_STS_A_DIR VA=1.8V VB=VDDPS
U_FPGA/U_DriveInterface/U_InverterTranslation/U_TranslationStsB: designators end in D; ports A1=LV_INV_STS_B1 A2=LV_INV_STS_B2 A3=LV_INV_STS_B3 A4=LV_INV_STS_B4 A5=NetU4D_7 A6=NetU4D_8 A7=NetU4D_9 A8=NetU4D_10 B1=INV_STS_B1 B2=INV_STS_B2 B3=INV_STS_B3 B4=INV_STS_B4 B5=NetU4D_17 B6=NetU4D_16 B7=NetU4D_15 B8=NetU4D_14 DIR=INV_STS_B_DIR VA=1.8V VB=VDDPS
U_FPGA/U_DriveInterface/U_InverterTranslation/U_TranslationStsC: designators end in E; ports A1=LV_INV_STS_C1 A2=LV_INV_STS_C2 A3=LV_INV_STS_C3 A4=LV_INV_STS_C4 A5=NetU4E_7 A6=NetU4E_8 A7=NetU4E_9 A8=NetU4E_10 B1=INV_STS_C1 B2=INV_STS_C2 B3=INV_STS_C3 B4=INV_STS_C4 B5=NetU4E_17 B6=NetU4E_16 B7=NetU4E_15 B8=NetU4E_14 DIR=INV_STS_C_DIR VA=1.8V VB=VDDPS
U_FPGA/U_DriveInterface/U_InverterTranslation/U_TranslationStsD: designators end in F; ports A1=LV_INV_STS_D1 A2=LV_INV_STS_D2 A3=LV_INV_STS_D3 A4=LV_INV_STS_D4 A5=NetU4F_7 A6=NetU4F_8 A7=NetU4F_9 A8=NetU4F_10 B1=INV_STS_D1 B2=INV_STS_D2 B3=INV_STS_D3 B4=INV_STS_D4 B5=NetU4F_17 B6=NetU4F_16 B7=NetU4F_15 B8=NetU4F_14 DIR=INV_STS_D_DIR VA=1.8V VB=VDDPS

### Notes on the sheet
- Title:
- File:
- Sheet:
- of
- Revision:
- Time:
- Date:
- Engineer:

### Library data of the parts
U4 = SN74LVC8T245PWR: IC BUS TRANSCVR 8BIT 24TSSOP; Supplier 1: Digi-Key; Supplier Part Number 1: 296-18593-1-ND
C7 C8 = Capacitor: Supplier 1: Digi-Key; Supplier Part Number 1: 1276-1012-1-ND

## Sheet USB_UART.SchDoc: USB UART
size Letter; Engineer: Nathan Petersen; DocumentNumber: 9; Revision: v1.2; SheetNumber: 9; SheetTotal: 26
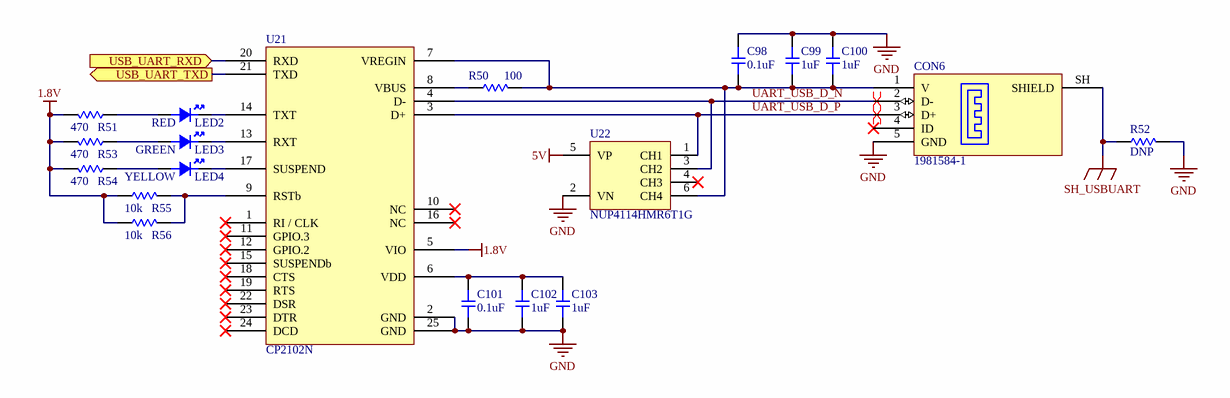
[diagram p5: USB_UART.SchDoc]

### Parts
C98  value 0.1uF  [0603-CAP]  (hidden comment: Capacitor)
C99  value 1uF  [0603-CAP]  (hidden comment: Capacitor)
C100  value 1uF  [0603-CAP]  (hidden comment: Capacitor)
C101  value 0.1uF  [0603-CAP]  (hidden comment: Capacitor)
C102  value 1uF  [0603-CAP]  (hidden comment: Capacitor)
C103  value 1uF  [0603-CAP]  (hidden comment: Capacitor)
CON6  1981584-1  [1981584-1]
LED2  value RED  [0603-LED]  (hidden comment: LED)
LED3  value GREEN  [0603-LED]  (hidden comment: LED)
LED4  value YELLOW  [0603-LED]  (hidden comment: LED)
R50  value 100  [0603-RES]  (hidden comment: Resistor)
R51  value 470  [0603-RES]  (hidden comment: Resistor)
R52  value DNP  [0603-RES]  (hidden comment: Resistor)
R53  value 470  [0603-RES]  (hidden comment: Resistor)
R54  value 470  [0603-RES]  (hidden comment: Resistor)
R55  value 10k  [0603-RES]  (hidden comment: Resistor)
R56  value 10k  [0603-RES]  (hidden comment: Resistor)
U21  CP2102N  [QFN50P400X400X80_HS-25N]
U22  NUP4114HMR6T1G  [TSOP95P280X110-6N]

### Ports
USB_UART_RXD (in), USB_UART_TXD (out)

### Nets
1.8V: R51.2 R53.2 R54.2 R55.1 R56.1 U21.5(VIO)
5V: U22.5(VP)
GND: C98.2 C99.2 C100.2 C101.1 C102.1 C103.1 CON6.5(GND) R52.2 U21.2(GND) U21.25(GND) U22.2(VN)
SH_USBUART: CON6.SH(SHIELD) R52.1
UART_USB_D_N: CON6.2(D-) U21.4(D-) U22.3(CH2)
UART_USB_D_P: CON6.3(D+) U21.3(D+) U22.1(CH1)
USB_UART_RXD: U21.20(RXD) ; port USB_UART_RXD
USB_UART_TXD: U21.21(TXD) ; port USB_UART_TXD
NetC98_1: C98.1 C99.1 C100.1 CON6.1(V) R50.2 U21.7(VREGIN) U22.6(CH4)
NetC101_2: C101.2 C102.2 C103.2 U21.6(VDD)
NetLED2_A: LED2.A R51.1
NetLED2_C: LED2.C U21.14(TXT)
NetLED3_A: LED3.A R53.1
NetLED3_C: LED3.C U21.13(RXT)
NetLED4_A: LED4.A R54.1
NetLED4_C: LED4.C U21.17(SUSPEND)
NetR50_1: R50.1 U21.8(VBUS)
NetR55_2: R55.2 R56.2 U21.9(RSTb)

Not connected (* = marked no-connect by the designer): CON6 4(ID)*; U21 1(RI_/_CLK)* 10(NC)* 11(GPIO.3)* 12(GPIO.2)* 15(SUSPENDb)* 16(NC)* 18(CTS)* 19(RTS)* 22(DSR)* 23(DTR)* 24(DCD)*; U22 4(CH3)*

### Layout directives
differential pair: UART_USB_D_N, UART_USB_D_P

### Notes on the sheet
- Title:
- File:
- Sheet:
- of
- Revision:
- Time:
- Date:
- Engineer:

### Library data of the parts
CON6 = 1981584-1: CONN RCPT MICRO USB TYPE AB; Supplier 1: Digi-Key; Supplier Part Number 1: A97799TR-ND
U21 = CP2102N: IC USB TO UART BRIDGE QFN24; Supplier 1: Digi-Key; Supplier Part Number 1: 336-5888-1-ND
U22 = NUP4114HMR6T1G: TVS DIODE 5.5V 10V 6TSOP; Supplier 1: Digi-Key; Supplier Part Number 1: NUP4114HMR6T1GOSCT-ND
C98-C103 = Capacitor: Supplier 1: Digi-Key
  C98 C101: Supplier Part Number 1: 1276-1012-1-ND
  C99 C100 C102 C103: Supplier Part Number 1: 1276-6524-1-ND
LED2-LED4 = LED: Supplier 1: Digi-Key
  LED2: Supplier Part Number 1: 160-1447-1-ND
  LED3: Supplier Part Number 1: 160-1446-1-ND
  LED4: Supplier Part Number 1: 160-1448-1-ND
R50-R56 = Resistor: Supplier 1: Digi-Key
  R50: Supplier Part Number 1: YAG3561CT-ND
  R51 R53 R54: Supplier Part Number 1: 311-470LDCT-ND
  R52: Supplier Part Number 1: P0.0GCT-ND
  R55 R56: Supplier Part Number 1: P10.0KHCT-ND

## Sheet SWD.SchDoc: SWD
size 279 x 215 mm; Engineer: Prasoon Sinha; DocumentNumber: 7; SheetNumber: 7; SheetTotal: 26
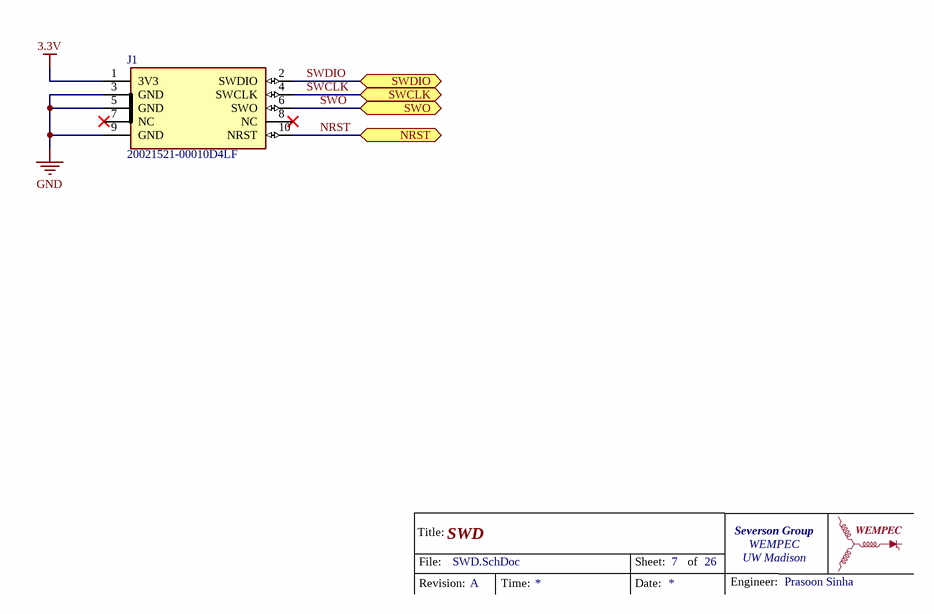
[diagram p6: SWD.SchDoc]

### Parts
(Parts that share a designator on the sheet are numbered #1, #2 ... from top to bottom, then left to right.)
*?#3  TitleBlockWEMPEC  (value not drawn)  (graphical)
J1  20021521-00010D4LF  [20021521-00010D4LF]

### Ports
NRST (bidir), SWCLK (bidir), SWDIO (bidir), SWO (bidir)

### Nets
3.3V: J1.1(3V3)
GND: J1.3(GND) J1.5(GND) J1.9(GND)
NRST: J1.10(NRST) ; port NRST
SWCLK: J1.4(SWCLK) ; port SWCLK
SWDIO: J1.2(SWDIO) ; port SWDIO
SWO: J1.6(SWO) ; port SWO

Not connected (* = marked no-connect by the designer): J1 7(NC)* 8(NC)*

### Notes on the sheet
- (in symbol TitleBlockWEMPEC) Title:; File:; Sheet:; of; Engineer:; Revision:; Time:; Date:

### Library data of the parts
J1 = 20021521-00010D4LF: SWD Connector Header Surface Mount 10 position 0.050" (1.27mm); Supplier Part Number 1: 609-6533-ND

## Sheet USB.SchDoc: USB
size 279 x 215 mm; Engineer: Prasoon Sinha; DocumentNumber: 8; SheetNumber: 8; SheetTotal: 26
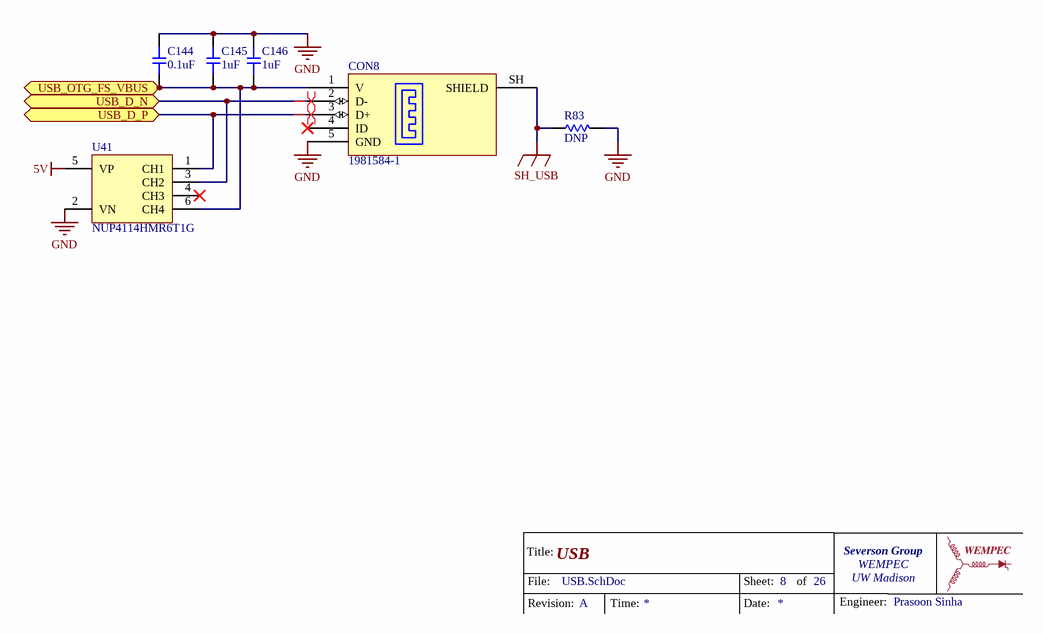
[diagram p7: USB.SchDoc]

### Parts
(Parts that share a designator on the sheet are numbered #1, #2 ... from top to bottom, then left to right.)
*?#4  TitleBlockWEMPEC  (value not drawn)  (graphical)
C144  value 0.1uF  [0603-CAP]  (hidden comment: Capacitor)
C145  value 1uF  [0603-CAP]  (hidden comment: Capacitor)
C146  value 1uF  [0603-CAP]  (hidden comment: Capacitor)
CON8  1981584-1  [1981584-1]
R83  value DNP  [0603-RES]  (hidden comment: Resistor)
U41  NUP4114HMR6T1G  [TSOP95P280X110-6N]

### Ports
USB_D_N (bidir), USB_D_P (bidir), USB_OTG_FS_VBUS (bidir)

### Nets
5V: U41.5(VP)
GND: C144.2 C145.2 C146.2 CON8.5(GND) R83.2 U41.2(VN)
SH_USB: CON8.SH(SHIELD) R83.1
USB_D_N: CON8.2(D-) U41.3(CH2) ; port USB_D_N
USB_D_P: CON8.3(D+) U41.1(CH1) ; port USB_D_P
NetC144_1: C144.1 C145.1 C146.1 CON8.1(V) U41.6(CH4) ; port USB_OTG_FS_VBUS

Not connected (* = marked no-connect by the designer): CON8 4(ID)*; U41 4(CH3)*

### Layout directives
differential pair: USB_D_N, USB_D_P

### Notes on the sheet
- (in symbol TitleBlockWEMPEC) Title:; File:; Sheet:; of; Engineer:; Revision:; Time:; Date:

### Library data of the parts
CON8 = 1981584-1: CONN RCPT MICRO USB TYPE AB; Supplier 1: Digi-Key; Supplier Part Number 1: A97799TR-ND
U41 = NUP4114HMR6T1G: TVS DIODE 5.5V 10V 6TSOP; Supplier 1: Digi-Key; Supplier Part Number 1: NUP4114HMR6T1GOSCT-ND
C144-C146 = Capacitor: Supplier 1: Digi-Key
  C144: Supplier Part Number 1: 1276-1012-1-ND
  C145 C146: Supplier Part Number 1: 1276-6524-1-ND
R83 = Resistor: Supplier 1: Digi-Key; Supplier Part Number 1: P0.0GCT-ND

## Sheet Ethernet.SchDoc: Ethernet
size 279 x 215 mm; Engineer: Prasoon Sinha; DocumentNumber: 3; SheetNumber: 10; SheetTotal: 26
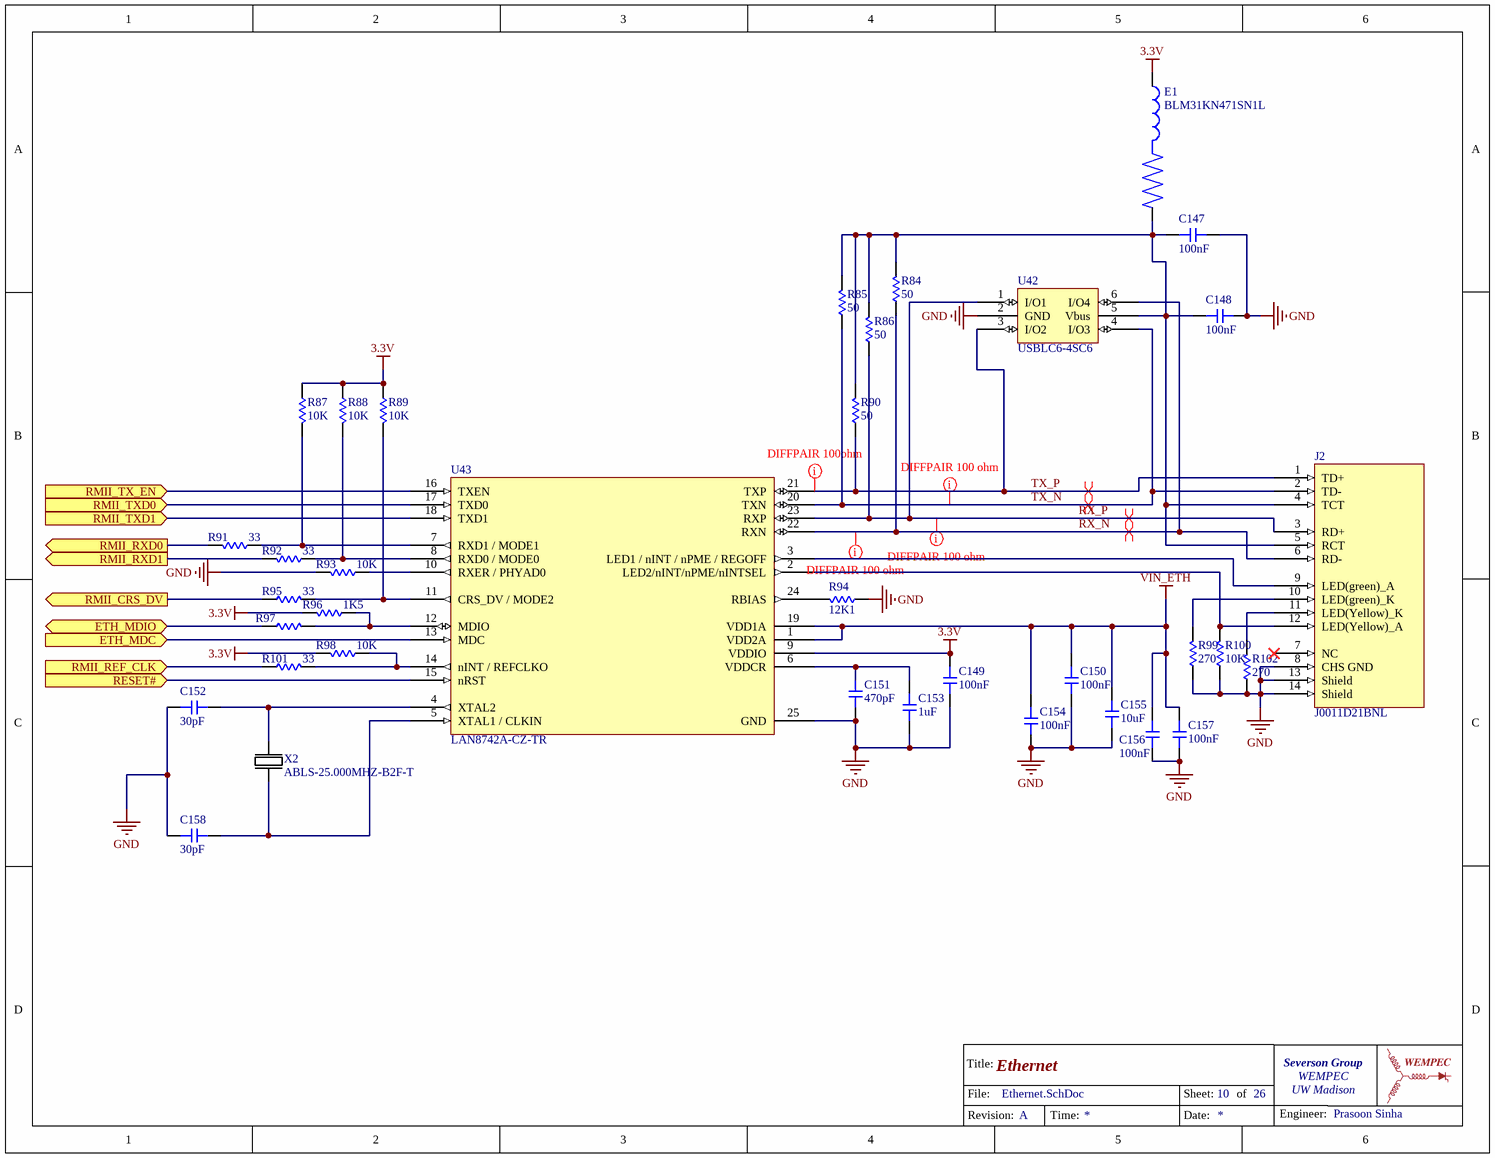
[diagram p8: Ethernet.SchDoc]

### Parts
(Parts that share a designator on the sheet are numbered #1, #2 ... from top to bottom, then left to right.)
*?#5  TitleBlockWEMPEC  (value not drawn)  (graphical)
C147  value 100nF  [0603-CAP]  (hidden comment: Capacitor)
C148  value 100nF  [0603-CAP]  (hidden comment: Capacitor)
C149  value 100nF  [0603-CAP]  (hidden comment: Capacitor)
C150  value 100nF  [0603-CAP]  (hidden comment: Capacitor)
C151  470pF  [0603-CAP]
C152  30pF  [0603-CAP]
C153  1uF  [0603-CAP]
C154  value 100nF  [0603-CAP]  (hidden comment: Capacitor)
C155  10uF  [0603-CAP]
C156  value 100nF  [0603-CAP]  (hidden comment: Capacitor)
C157  value 100nF  [0603-CAP]  (hidden comment: Capacitor)
C158  30pF  [0603-CAP]
E1  BLM31KN471SN1L  [BEADC3216X180N]
J2  J0011D21BNL  [J0011D21BNL]
R84  value 50  [0603-RES]  (hidden comment: Resistor)
R85  value 50  [0603-RES]  (hidden comment: Resistor)
R86  value 50  [0603-RES]  (hidden comment: Resistor)
R87  value 10K  [0603-RES]  (hidden comment: Resistor)
R88  value 10K  [0603-RES]  (hidden comment: Resistor)
R89  value 10K  [0603-RES]  (hidden comment: Resistor)
R90  value 50  [0603-RES]  (hidden comment: Resistor)
R91  value 33  [0603-RES]  (hidden comment: Resistor)
R92  value 33  [0603-RES]  (hidden comment: Resistor)
R93  value 10K  [0603-RES]  (hidden comment: Resistor)
R94  value 12K1  [0603-RES]  (hidden comment: Resistor)
R95  value 33  [0603-RES]  (hidden comment: Resistor)
R96  value 1K5  [0603-RES]  (hidden comment: Resistor)
R97  Resistor  [0603-RES]  (value not drawn)
R98  value 10K  [0603-RES]  (hidden comment: Resistor)
R99  value 270  [0603-RES]  (hidden comment: Resistor)
R100  value 10K  [0603-RES]  (hidden comment: Resistor)
R101  value 33  [0603-RES]  (hidden comment: Resistor)
R102  value 270  [0603-RES]  (hidden comment: Resistor)
U42  USBLC6-4SC6  [SOT95P280X145-6N]
U43  LAN8742A-CZ-TR  [QFN50P400X400X100_HS-25N]
X2  ABLS-25.000MHZ-B2F-T  [XTAL_ABLS-8.000MHZ-B2-T]

### Ports
ETH_MDC (in), ETH_MDIO (bidir), RESET# (in), RMII_CRS_DV (out), RMII_REF_CLK (in), RMII_RXD0 (out), RMII_RXD1 (out), RMII_TX_EN (in), RMII_TXD0 (in), RMII_TXD1 (in)

### Nets
3.3V: C149.2 E1.1 R87.1 R88.1 R89.1 R96.2 R98.2 U43.9(VDDIO)
GND: C147.1 C148.1 C149.1 C150.1 C151.1 C152.2 C153.1 C154.1 C155.1 C156.1 C157.1 C158.2 J2.8(CHS_GND) J2.13(Shield) J2.14(Shield) R93.2 R94.1 R99.1 R100.1 R102.1 U42.2(GND) U43.25(GND)
VIN_ETH: C150.2 C154.2 C155.2 C156.2 C157.2 U43.1(VDD2A) U43.19(VDD1A)
ETH_MDC: U43.13(MDC) ; port ETH_MDC
ETH_MDIO: R97.1 ; port ETH_MDIO
NRST: U43.15(nRST) ; port RESET#
RMII_CRS_DV: R95.1 ; port RMII_CRS_DV
RMII_REF_CLK: R101.1 ; port RMII_REF_CLK
RMII_RXD0: R91.2 ; port RMII_RXD0
RMII_RXD1: R92.2 ; port RMII_RXD1
RMII_TX_EN: U43.16(TXEN) ; port RMII_TX_EN
RMII_TXD0: U43.17(TXD0) ; port RMII_TXD0
RMII_TXD1: U43.18(TXD1) ; port RMII_TXD1
RX_N: J2.6(RD-) R84.1 U42.6(I/O4) U43.22(RXN)
RX_P: J2.3(RD+) R86.1 U42.1(I/O1) U43.23(RXP)
TX_N: J2.2(TD-) R85.1 U42.4(I/O3) U43.20(TXN)
TX_P: J2.1(TD+) R90.1 U42.3(I/O2) U43.21(TXP)
NetC147_2: C147.2 C148.2 E1.2 J2.4(TCT) J2.5(RCT) R84.2 R85.2 R86.2 R90.2 U42.5(Vbus)
NetC151_2: C151.2 C153.2 U43.6(VDDCR)
NetC152_1: C152.1 U43.4(XTAL2) X2.2
NetC158_1: C158.1 U43.5(XTAL1_/_CLKIN) X2.1
NetJ2_9: J2.9(LED(green)_A) U43.3(LED1_/_nINT_/_nPME_/_REGOFF)
NetJ2_10: J2.10(LED(green)_K) R99.2
NetJ2_11: J2.11(LED(Yellow)_K) R102.2
NetJ2_12: J2.12(LED(Yellow)_A) R100.2 U43.2(LED2/nINT/nPME/nINTSEL)
NetR87_2: R87.2 R91.1 U43.7(RXD1_/_MODE1)
NetR88_2: R88.2 R92.1 U43.8(RXD0_/_MODE0)
NetR89_2: R89.2 R95.2 U43.11(CRS_DV_/_MODE2)
NetR93_1: R93.1 U43.10(RXER_/_PHYAD0)
NetR94_2: R94.2 U43.24(RBIAS)
NetR96_1: R96.1 R97.2 U43.12(MDIO)
NetR98_1: R98.1 R101.2 U43.14(nINT_/_REFCLKO)

Not connected (* = marked no-connect by the designer): J2 7(NC)*

### Layout directives
differential pair: RX_N, RX_P, TX_N, TX_P
mark named DIFFPAIR 100ohm: TX_P
mark named DIFFPAIR 100 ohm: RX_N, RX_P, TX_N

### Notes on the sheet
- (in symbol TitleBlockWEMPEC) Title:; File:; Sheet:; of; Engineer:; Revision:; Time:; Date:

### Library data of the parts
C151-C153 C155 C158 = Capacitor
  C151: Supplier Part Number 1: 709-1085-1-ND
  C152 C158: Supplier Part Number 1: 311-3894-1-ND
  C153: Supplier Part Number 1: 1276-6524-1-ND
  C155: Supplier Part Number 1: 311-3494-1-ND
E1 = BLM31KN471SN1L: Power Line Ferrite Bead 1206 (3216 Metric) 4A 20mOhm; Supplier Part Number 1: 490-16530-1-ND
J2 = J0011D21BNL: 1 Port RJ45 Magjack Connector Through Hole 10/100 Base-TX, AutoMDIX; Supplier Part Number 1: 553-1485-ND
R97 = Resistor: Value: 0; Supplier 1: Digi-Key; Supplier Part Number 1: 311-470LDCT-ND
U42 = USBLC6-4SC6: 17V Clamp 5A (8/20µs) Ipp Tvs Diode Surface Mount SOT-23-6; Supplier Part Number 1: 497-4492-1-ND
U43 = LAN8742A-CZ-TR: 1/1 Transceiver Ethernet 24-SQFN (4x4); Supplier Part Number 1: LAN8742A-CZ-CT-ND
X2 = ABLS-25.000MHZ-B2F-T: 25MHz ±20ppm Crystal 18pF 40 Ohms HC-49/US; Supplier Part Number 1: 535-9078-1-ND
C147-C150 C154 C156 C157 = Capacitor: Supplier 1: Digi-Key; Supplier Part Number 1: 1276-1012-1-ND
R84-R96 R98-R102 = Resistor: Supplier 1: Digi-Key
  R84-R86 R90: Supplier Part Number 1: 541-3318-1-ND
  R87-R89 R93 R98 R100: Supplier Part Number 1: 541-5136-1-ND
  R91 R92 R95 R101: Supplier Part Number 1: RMCF0603FT33R0CT-ND
  R94: Supplier Part Number 1: 541-5158-1-ND
  R96: Supplier Part Number 1: RMCF0603FT1K50CT-ND
  R99 R102: Supplier Part Number 1: 541-270HCT-ND

## Sheet FPGA.SchDoc: FPGA Interface
size 431 x 254 mm; Engineer: Prasoon Sinha; DocumentNumber: 3; SheetNumber: 3; SheetTotal: 26
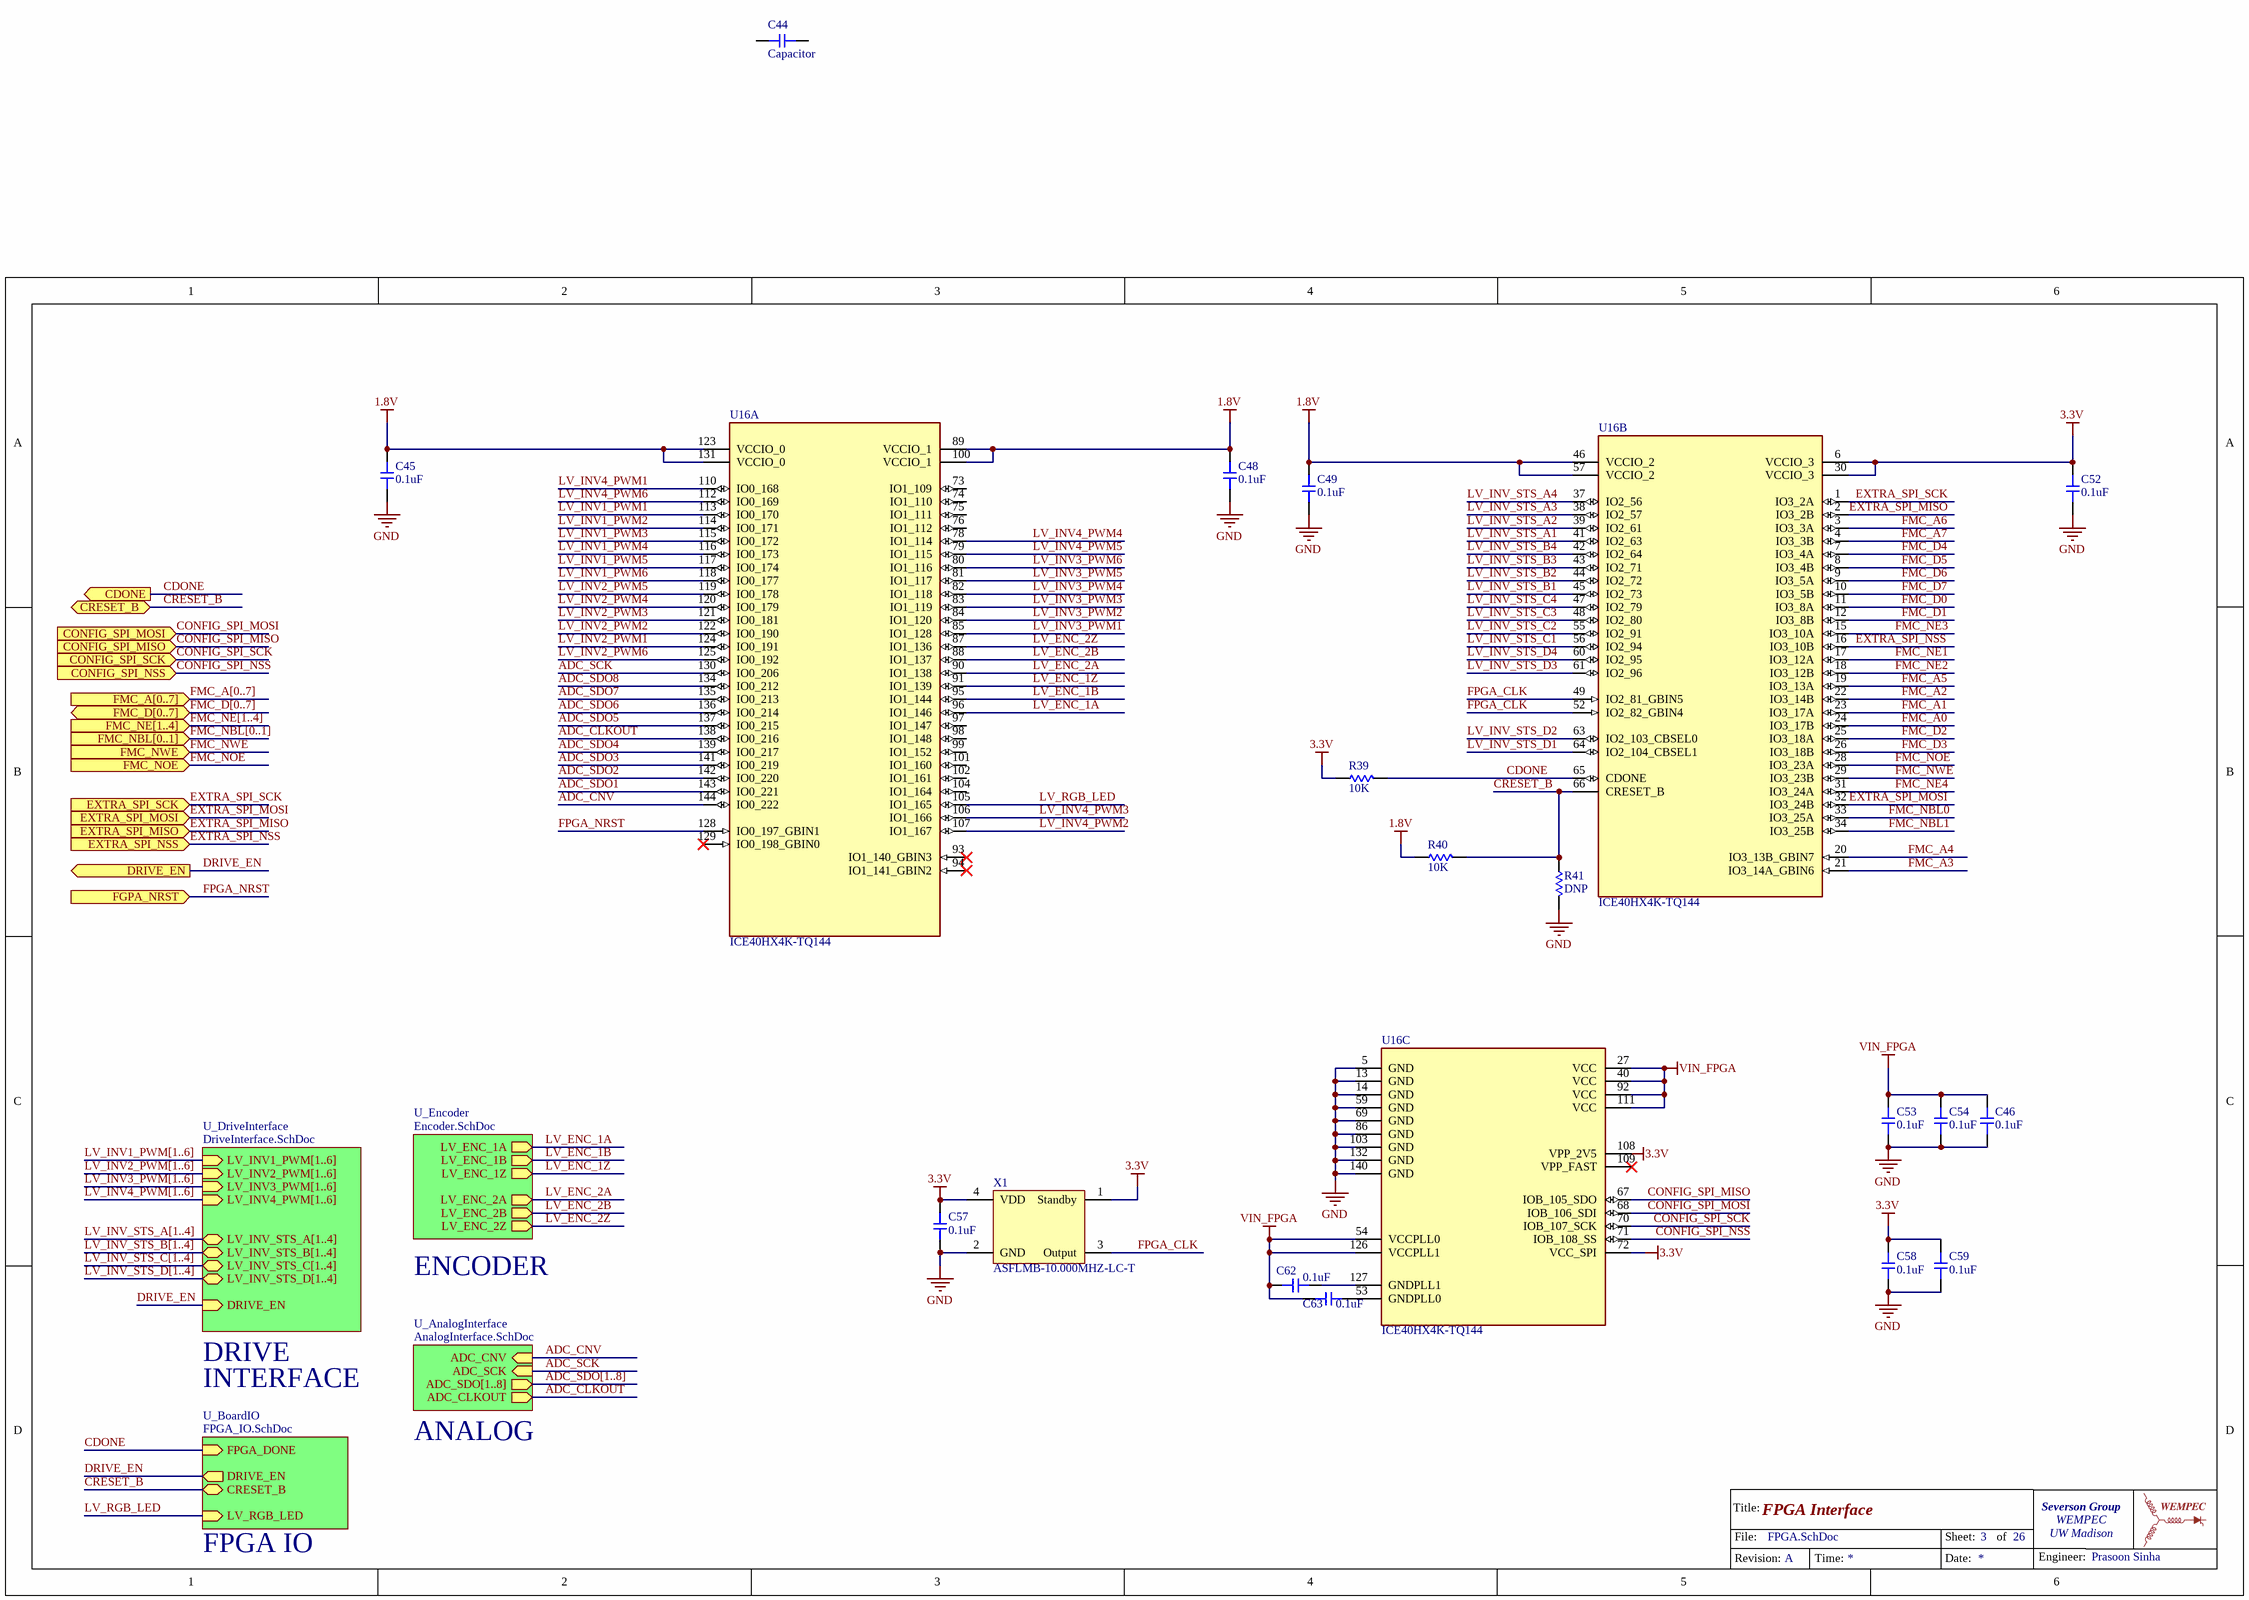
[diagram p9: FPGA.SchDoc]

### Parts
(Parts that share a designator on the sheet are numbered #1, #2 ... from top to bottom, then left to right.)
*?#6  TitleBlockWEMPEC  (value not drawn)  (graphical)
C44  Capacitor
C45  value 0.1uF  [0603-CAP]  (hidden comment: Capacitor)
C46  value 0.1uF  [0603-CAP]  (hidden comment: Capacitor)
C48  value 0.1uF  [0603-CAP]  (hidden comment: Capacitor)
C49  value 0.1uF  [0603-CAP]  (hidden comment: Capacitor)
C52  value 0.1uF  [0603-CAP]  (hidden comment: Capacitor)
C53  value 0.1uF  [0603-CAP]  (hidden comment: Capacitor)
C54  value 0.1uF  [0603-CAP]  (hidden comment: Capacitor)
C57  value 0.1uF  [0603-CAP]  (hidden comment: Capacitor)
C58  value 0.1uF  [0603-CAP]  (hidden comment: Capacitor)
C59  value 0.1uF  [0603-CAP]  (hidden comment: Capacitor)
C62  value 0.1uF  [0603-CAP]  (hidden comment: Capacitor)
C63  value 0.1uF  [0603-CAP]  (hidden comment: Capacitor)
R39  value 10K  [0603-RES]  (hidden comment: Resistor)
R40  value 10K  [0603-RES]  (hidden comment: Resistor)
R41  value DNP  [0603-RES]  (hidden comment: Resistor)
U16  ICE40HX4K-TQ144  [QFP50P2200X2200X160-144N]  (parts A,B,C of 3)
X1  ASFLMB-10.000MHZ-LC-T  [ASFLMB-50.000MHZ-LC-T]

### Sub-sheets
U_AnalogInterface = AnalogInterface.SchDoc: ADC_SDO[1..8] (out), ADC_CNV (in), ADC_SCK (in), ADC_CLKOUT (out)
U_BoardIO = FPGA_IO.SchDoc: FPGA_DONE (in), DRIVE_EN (out), LV_RGB_LED (in), CRESET_B (bidir)
U_DriveInterface = DriveInterface.SchDoc: LV_INV2_PWM[1..6] (in), LV_INV3_PWM[1..6] (in), LV_INV4_PWM[1..6] (in), LV_INV1_PWM[1..6] (in), DRIVE_EN (in), LV_INV_STS_A[1..4] (bidir), LV_INV_STS_D[1..4] (bidir), LV_INV_STS_C[1..4] (bidir), LV_INV_STS_B[1..4] (bidir)
U_Encoder = Encoder.SchDoc: LV_ENC_1A (out), LV_ENC_1B (out), LV_ENC_1Z (out), LV_ENC_2A (out), LV_ENC_2B (out), LV_ENC_2Z (out)

### Ports
CDONE (out), CONFIG_SPI_MISO (in), CONFIG_SPI_MOSI (in), CONFIG_SPI_NSS (in), CONFIG_SPI_SCK (in), CRESET_B (bidir), DRIVE_EN (out), EXTRA_SPI_MISO (in), EXTRA_SPI_MOSI (in), EXTRA_SPI_NSS (in), EXTRA_SPI_SCK (in), FGPA_NRST (in), FMC_A[0..7] (in), FMC_D[0..7] (bidir), FMC_NBL[0..1] (in), FMC_NE[1..4] (in), FMC_NOE (in), FMC_NWE (in)

### Nets
1.8V: C45.1 C48.1 C49.1 R40.1 U16.46(VCCIO_2) U16.57(VCCIO_2) U16.89(VCCIO_1) U16.100(VCCIO_1) U16.123(VCCIO_0) U16.131(VCCIO_0)
3.3V: C52.1 C57.1 C58.1 C59.1 R39.1 U16.6(VCCIO_3) U16.30(VCCIO_3) U16.72(VCC_SPI) X1.1(Standby) X1.4(VDD)
GND: C45.2 C46.2 C48.2 C49.2 C52.2 C53.2 C54.2 C57.2 C58.2 C59.2 R41.2 U16.5(GND) U16.13(GND) U16.14(GND) U16.59(GND) U16.69(GND) U16.86(GND) U16.103(GND) U16.132(GND) U16.140(GND) X1.2(GND)
VIN_FPGA: C46.1 C53.1 C54.1 C62.1 C63.1 U16.27(VCC) U16.40(VCC) U16.54(VCCPLL0) U16.92(VCC) U16.111(VCC) U16.126(VCCPLL1)
ADC_CLKOUT: U16.138(IO0_216) ; sheet U_AnalogInterface/ADC_CLKOUT
ADC_CNV: U16.144(IO0_222) ; sheet U_AnalogInterface/ADC_CNV
ADC_SCK: U16.130(IO0_206) ; sheet U_AnalogInterface/ADC_SCK
ADC_SDO1: U16.143(IO0_221)
ADC_SDO2: U16.142(IO0_220)
ADC_SDO3: U16.141(IO0_219)
ADC_SDO4: U16.139(IO0_217)
ADC_SDO5: U16.137(IO0_215)
ADC_SDO6: U16.136(IO0_214)
ADC_SDO7: U16.135(IO0_213)
ADC_SDO8: U16.134(IO0_212)
CDONE: R39.2 U16.65(CDONE) ; port CDONE, sheet U_BoardIO/FPGA_DONE
CONFIG_SPI_MISO: U16.67(IOB_105_SDO) ; port CONFIG_SPI_MISO  [project net CONFIG_SPI5_MISO]
CONFIG_SPI_MOSI: U16.68(IOB_106_SDI) ; port CONFIG_SPI_MOSI  [project net CONFIG_SPI5_MOSI]
CONFIG_SPI_NSS: U16.71(IOB_108_SS) ; port CONFIG_SPI_NSS  [project net CONFIG_SPI5_NSS]
CONFIG_SPI_SCK: U16.70(IOB_107_SCK) ; port CONFIG_SPI_SCK  [project net CONFIG_SPI5_SCK]
CRESET_B: R40.2 R41.1 U16.66(CRESET_B) ; port CRESET_B, sheet U_BoardIO/CRESET_B
DRIVE_EN: port DRIVE_EN, sheet U_DriveInterface/DRIVE_EN, sheet U_BoardIO/DRIVE_EN
EXTRA_SPI_MISO: U16.2(IO3_2B) ; port EXTRA_SPI_MISO  [project net EXTRA_SPI6_MISO]
EXTRA_SPI_MOSI: U16.32(IO3_24B) ; port EXTRA_SPI_MOSI  [project net EXTRA_SPI6_MOSI]
EXTRA_SPI_NSS: U16.16(IO3_10B) ; port EXTRA_SPI_NSS  [project net EXTRA_SPI6_NSS]
EXTRA_SPI_SCK: U16.1(IO3_2A) ; port EXTRA_SPI_SCK  [project net EXTRA_SPI6_SCK]
FMC_A0: U16.24(IO3_17B)
FMC_A1: U16.23(IO3_17A)
FMC_A2: U16.22(IO3_14B)
FMC_A3: U16.21(IO3_14A_GBIN6)
FMC_A4: U16.20(IO3_13B_GBIN7)
FMC_A5: U16.19(IO3_13A)
FMC_A6: U16.3(IO3_3A)
FMC_A7: U16.4(IO3_3B)
FMC_D0: U16.11(IO3_8A)
FMC_D1: U16.12(IO3_8B)
FMC_D2: U16.25(IO3_18A)
FMC_D3: U16.26(IO3_18B)
FMC_D4: U16.7(IO3_4A)
FMC_D5: U16.8(IO3_4B)
FMC_D6: U16.9(IO3_5A)
FMC_D7: U16.10(IO3_5B)
FMC_NBL0: U16.33(IO3_25A)
FMC_NBL1: U16.34(IO3_25B)
FMC_NE1: U16.17(IO3_12A)
FMC_NE2: U16.18(IO3_12B)
FMC_NE3: U16.15(IO3_10A)
FMC_NE4: U16.31(IO3_24A)
FMC_NOE: U16.28(IO3_23A) ; port FMC_NOE
FMC_NWE: U16.29(IO3_23B) ; port FMC_NWE
FPGA_CLK: U16.49(IO2_81_GBIN5) U16.52(IO2_82_GBIN4) X1.3(Output)
FPGA_NRST: U16.128(IO0_197_GBIN1) ; port FGPA_NRST
LV_ENC_1A: U16.96(IO1_146) ; sheet U_Encoder/LV_ENC_1A
LV_ENC_1B: U16.95(IO1_144) ; sheet U_Encoder/LV_ENC_1B
LV_ENC_1Z: U16.91(IO1_139) ; sheet U_Encoder/LV_ENC_1Z
LV_ENC_2A: U16.90(IO1_138) ; sheet U_Encoder/LV_ENC_2A
LV_ENC_2B: U16.88(IO1_137) ; sheet U_Encoder/LV_ENC_2B
LV_ENC_2Z: U16.87(IO1_136) ; sheet U_Encoder/LV_ENC_2Z
LV_INV1_PWM1: U16.113(IO0_170)
LV_INV1_PWM2: U16.114(IO0_171)
LV_INV1_PWM3: U16.115(IO0_172)
LV_INV1_PWM4: U16.116(IO0_173)
LV_INV1_PWM5: U16.117(IO0_174)
LV_INV1_PWM6: U16.118(IO0_177)
LV_INV2_PWM1: U16.124(IO0_191)
LV_INV2_PWM2: U16.122(IO0_190)
LV_INV2_PWM3: U16.121(IO0_181)
LV_INV2_PWM4: U16.120(IO0_179)
LV_INV2_PWM5: U16.119(IO0_178)
LV_INV2_PWM6: U16.125(IO0_192)
LV_INV3_PWM1: U16.85(IO1_128)
LV_INV3_PWM2: U16.84(IO1_120)
LV_INV3_PWM3: U16.83(IO1_119)
LV_INV3_PWM4: U16.82(IO1_118)
LV_INV3_PWM5: U16.81(IO1_117)
LV_INV3_PWM6: U16.80(IO1_116)
LV_INV4_PWM1: U16.110(IO0_168)
LV_INV4_PWM2: U16.107(IO1_167)
LV_INV4_PWM3: U16.106(IO1_166)
LV_INV4_PWM4: U16.78(IO1_114)
LV_INV4_PWM5: U16.79(IO1_115)
LV_INV4_PWM6: U16.112(IO0_169)
LV_INV_STS_A1: U16.41(IO2_63)
LV_INV_STS_A2: U16.39(IO2_61)
LV_INV_STS_A3: U16.38(IO2_57)
LV_INV_STS_A4: U16.37(IO2_56)
LV_INV_STS_B1: U16.45(IO2_73)
LV_INV_STS_B2: U16.44(IO2_72)
LV_INV_STS_B3: U16.43(IO2_71)
LV_INV_STS_B4: U16.42(IO2_64)
LV_INV_STS_C1: U16.56(IO2_94)
LV_INV_STS_C2: U16.55(IO2_91)
LV_INV_STS_C3: U16.48(IO2_80)
LV_INV_STS_C4: U16.47(IO2_79)
LV_INV_STS_D1: U16.64(IO2_104_CBSEL1)
LV_INV_STS_D2: U16.63(IO2_103_CBSEL0)
LV_INV_STS_D3: U16.61(IO2_96)
LV_INV_STS_D4: U16.60(IO2_95)
LV_RGB_LED: U16.105(IO1_165) ; sheet U_BoardIO/LV_RGB_LED
NetC62_2: C62.2 U16.127(GNDPLL1)
NetC63_2: C63.2 U16.53(GNDPLL0)

Not connected (* = marked no-connect by the designer): C44 1 2; U16 73(IO1_109) 74(IO1_110) 75(IO1_111) 76(IO1_112) 93(IO1_140_GBIN3)* 94(IO1_141_GBIN2)* 97(IO1_147) 98(IO1_148) 99(IO1_152) 101(IO1_160) 102(IO1_161) 104(IO1_164) 108(VPP_2V5) 109(VPP_FAST)* 129(IO0_198_GBIN0)*

### Buses and harness runs
bus ADC_SDO[1..8] = sheet U_AnalogInterface/ADC_SDO[1..8]
bus FMC_A[0..7] = port FMC_A[0..7]
bus FMC_D[0..7] = port FMC_D[0..7]
bus FMC_NBL[0..1] = port FMC_NBL[0..1]
bus FMC_NE[1..4] = port FMC_NE[1..4]
bus LV_INV1_PWM[1..6] = sheet U_DriveInterface/LV_INV1_PWM[1..6]
bus LV_INV2_PWM[1..6] = sheet U_DriveInterface/LV_INV2_PWM[1..6]
bus LV_INV3_PWM[1..6] = sheet U_DriveInterface/LV_INV3_PWM[1..6]
bus LV_INV4_PWM[1..6] = sheet U_DriveInterface/LV_INV4_PWM[1..6]
bus LV_INV_STS_A[1..4] = sheet U_DriveInterface/LV_INV_STS_A[1..4]
bus LV_INV_STS_B[1..4] = sheet U_DriveInterface/LV_INV_STS_B[1..4]
bus LV_INV_STS_C[1..4] = sheet U_DriveInterface/LV_INV_STS_C[1..4]
bus LV_INV_STS_D[1..4] = sheet U_DriveInterface/LV_INV_STS_D[1..4]

### Notes on the sheet
- ENCODER
- DRIVE
- INTERFACE
- ANALOG
- FPGA IO
- Labels drawn without touching a wire or pin: 3.3V
- (in symbol TitleBlockWEMPEC) Title:; File:; Sheet:; of; Engineer:; Revision:; Time:; Date:

### Library data of the parts
U16 = ICE40HX4K-TQ144: IC FPGA 107 I/O 144TQFP; Supplier Part Number 1: 220-1572-ND
X1 = ASFLMB-10.000MHZ-LC-T: 10MHz XO (Standard) LVCMOS Oscillator 1.8V ~ 3.3V Standby (Power Down) 4-SMD, No Lead; Supplier Part Number 1: 535-11762-1-ND
C44-C46 C48 C49 C52-C54 C57-C59 C62 C63 = Capacitor
  C45 C46 C48 C49 C52-C54 C57-C59 C62 C63: Supplier 1: Digi-Key; Supplier Part Number 1: 1276-1012-1-ND
R39-R41 = Resistor: Supplier 1: Digi-Key
  R39 R40: Supplier Part Number 1: 541-5136-1-ND
  R41: Supplier Part Number 1: 311-470LDCT-ND

## Sheet DriveInterface.SchDoc: DriveInterface
size A; Engineer: Prasoon Sinha; DocumentNumber: 16; SheetNumber: 16; SheetTotal: 26
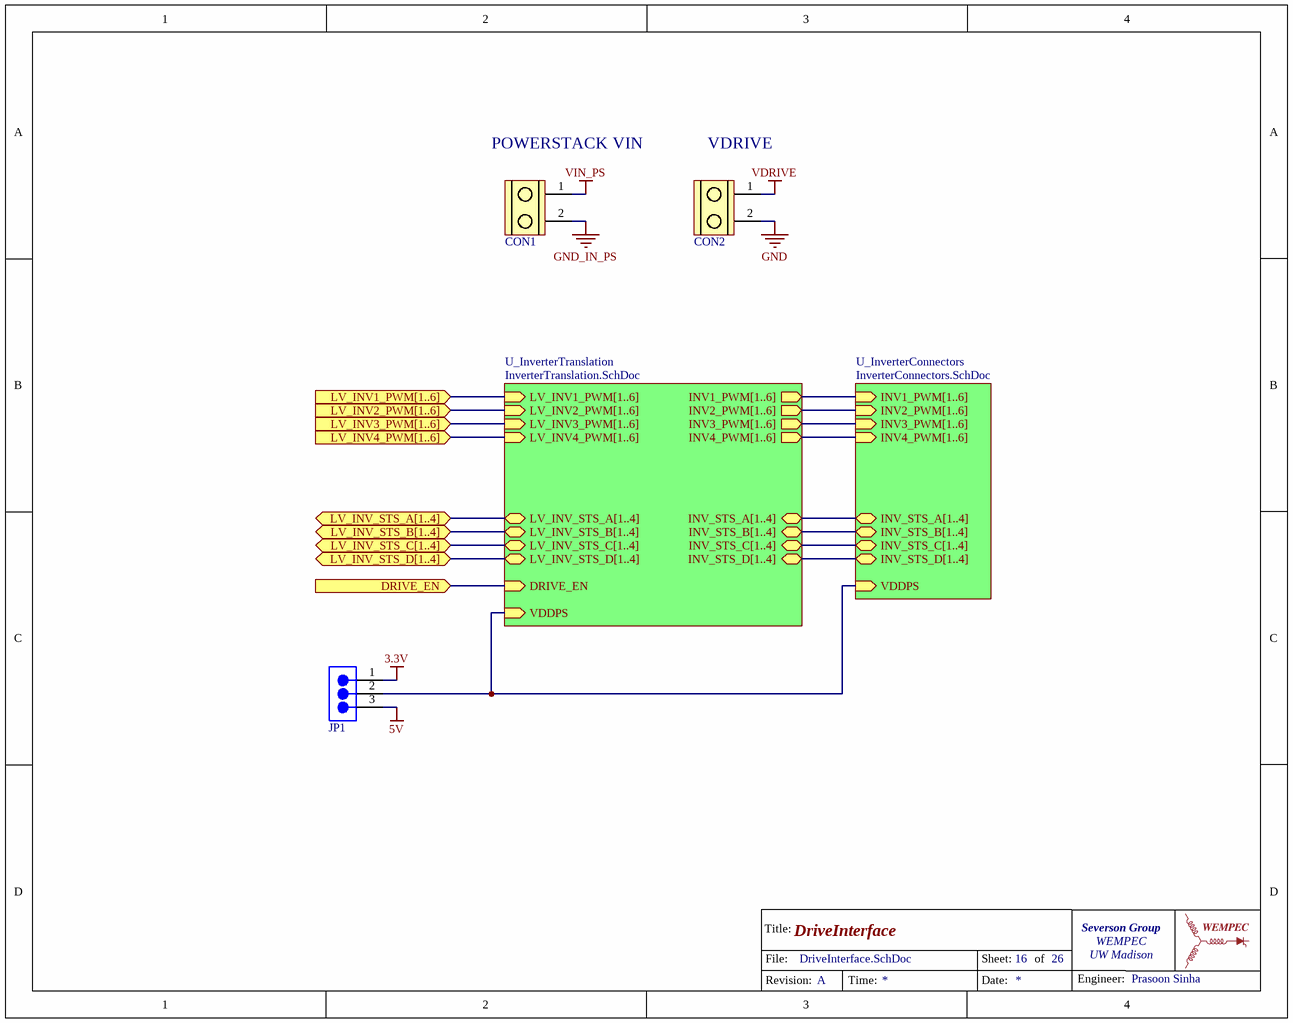
[diagram p10: DriveInterface.SchDoc]

### Parts
(Parts that share a designator on the sheet are numbered #1, #2 ... from top to bottom, then left to right.)
*?#7  TitleBlockWEMPEC  (value not drawn)  (graphical)
CON1  ScrewTerminal_1x2  [1935161]  (value not drawn)
CON2  ScrewTerminal_1x2  [1935161]  (value not drawn)
JP1  Jumper3  [PIN_HEADER_1X3]  (value not drawn)

### Sub-sheets
U_InverterConnectors = InverterConnectors.SchDoc: INV1_PWM[1..6] (in), INV3_PWM[1..6] (in), INV4_PWM[1..6] (in), INV2_PWM[1..6] (in), INV_STS_A[1..4] (bidir), INV_STS_C[1..4] (bidir), INV_STS_B[1..4] (bidir), INV_STS_D[1..4] (bidir), VDDPS (in)
U_InverterTranslation = InverterTranslation.SchDoc: LV_INV2_PWM[1..6] (in), LV_INV3_PWM[1..6] (in), LV_INV4_PWM[1..6] (in), LV_INV1_PWM[1..6] (in), DRIVE_EN (in), LV_INV_STS_A[1..4] (bidir), LV_INV_STS_D[1..4] (bidir), LV_INV_STS_C[1..4] (bidir), LV_INV_STS_B[1..4] (bidir), INV2_PWM[1..6] (out), INV3_PWM[1..6] (out), INV4_PWM[1..6] (out), INV1_PWM[1..6] (out), INV_STS_A[1..4] (bidir), INV_STS_B[1..4] (bidir), INV_STS_D[1..4] (bidir), INV_STS_C[1..4] (bidir), VDDPS (in)

### Ports
DRIVE_EN (in), LV_INV1_PWM[1..6] (in), LV_INV2_PWM[1..6] (in), LV_INV3_PWM[1..6] (in), LV_INV4_PWM[1..6] (in), LV_INV_STS_A[1..4] (bidir), LV_INV_STS_B[1..4] (bidir), LV_INV_STS_C[1..4] (bidir), LV_INV_STS_D[1..4] (bidir)

### Nets
3.3V: JP1.1
5V: JP1.3
GND: CON2.2
GND_IN_PS: CON1.2
VDRIVE: CON2.1
VIN_PS: CON1.1
DRIVE_EN: port DRIVE_EN, sheet U_InverterTranslation/DRIVE_EN
VDDPS: JP1.2 ; sheet U_InverterConnectors/VDDPS, sheet U_InverterTranslation/VDDPS

### Buses and harness runs
bus port LV_INV1_PWM[1..6] = sheet U_InverterTranslation/LV_INV1_PWM[1..6]
bus port LV_INV2_PWM[1..6] = sheet U_InverterTranslation/LV_INV2_PWM[1..6]
bus port LV_INV3_PWM[1..6] = sheet U_InverterTranslation/LV_INV3_PWM[1..6]
bus port LV_INV4_PWM[1..6] = sheet U_InverterTranslation/LV_INV4_PWM[1..6]
bus port LV_INV_STS_A[1..4] = sheet U_InverterTranslation/LV_INV_STS_A[1..4]
bus port LV_INV_STS_B[1..4] = sheet U_InverterTranslation/LV_INV_STS_B[1..4]
bus port LV_INV_STS_C[1..4] = sheet U_InverterTranslation/LV_INV_STS_C[1..4]
bus port LV_INV_STS_D[1..4] = sheet U_InverterTranslation/LV_INV_STS_D[1..4]
bus sheet U_InverterConnectors/INV1_PWM[1..6] = sheet U_InverterTranslation/INV1_PWM[1..6]
bus sheet U_InverterConnectors/INV2_PWM[1..6] = sheet U_InverterTranslation/INV2_PWM[1..6]
bus sheet U_InverterConnectors/INV3_PWM[1..6] = sheet U_InverterTranslation/INV3_PWM[1..6]
bus sheet U_InverterConnectors/INV4_PWM[1..6] = sheet U_InverterTranslation/INV4_PWM[1..6]
bus sheet U_InverterConnectors/INV_STS_A[1..4] = sheet U_InverterTranslation/INV_STS_A[1..4]
bus sheet U_InverterConnectors/INV_STS_B[1..4] = sheet U_InverterTranslation/INV_STS_B[1..4]
bus sheet U_InverterConnectors/INV_STS_C[1..4] = sheet U_InverterTranslation/INV_STS_C[1..4]
bus sheet U_InverterConnectors/INV_STS_D[1..4] = sheet U_InverterTranslation/INV_STS_D[1..4]

### Notes on the sheet
- (near CON1) POWERSTACK VIN
- (near CON2) VDRIVE
- (in symbol TitleBlockWEMPEC) Title:; File:; Sheet:; of; Engineer:; Revision:; Time:; Date:

### Library data of the parts
CON1 CON2 = ScrewTerminal_1x2: Supplier 1: Digi-Key; Supplier Part Number 1: 277-1667-ND
JP1 = Jumper3: Supplier 1: Digi-Key; Supplier Part Number 1: 732-5316-ND